# EAGLE schematic Flight Controller (EAGLE 8.2.2)
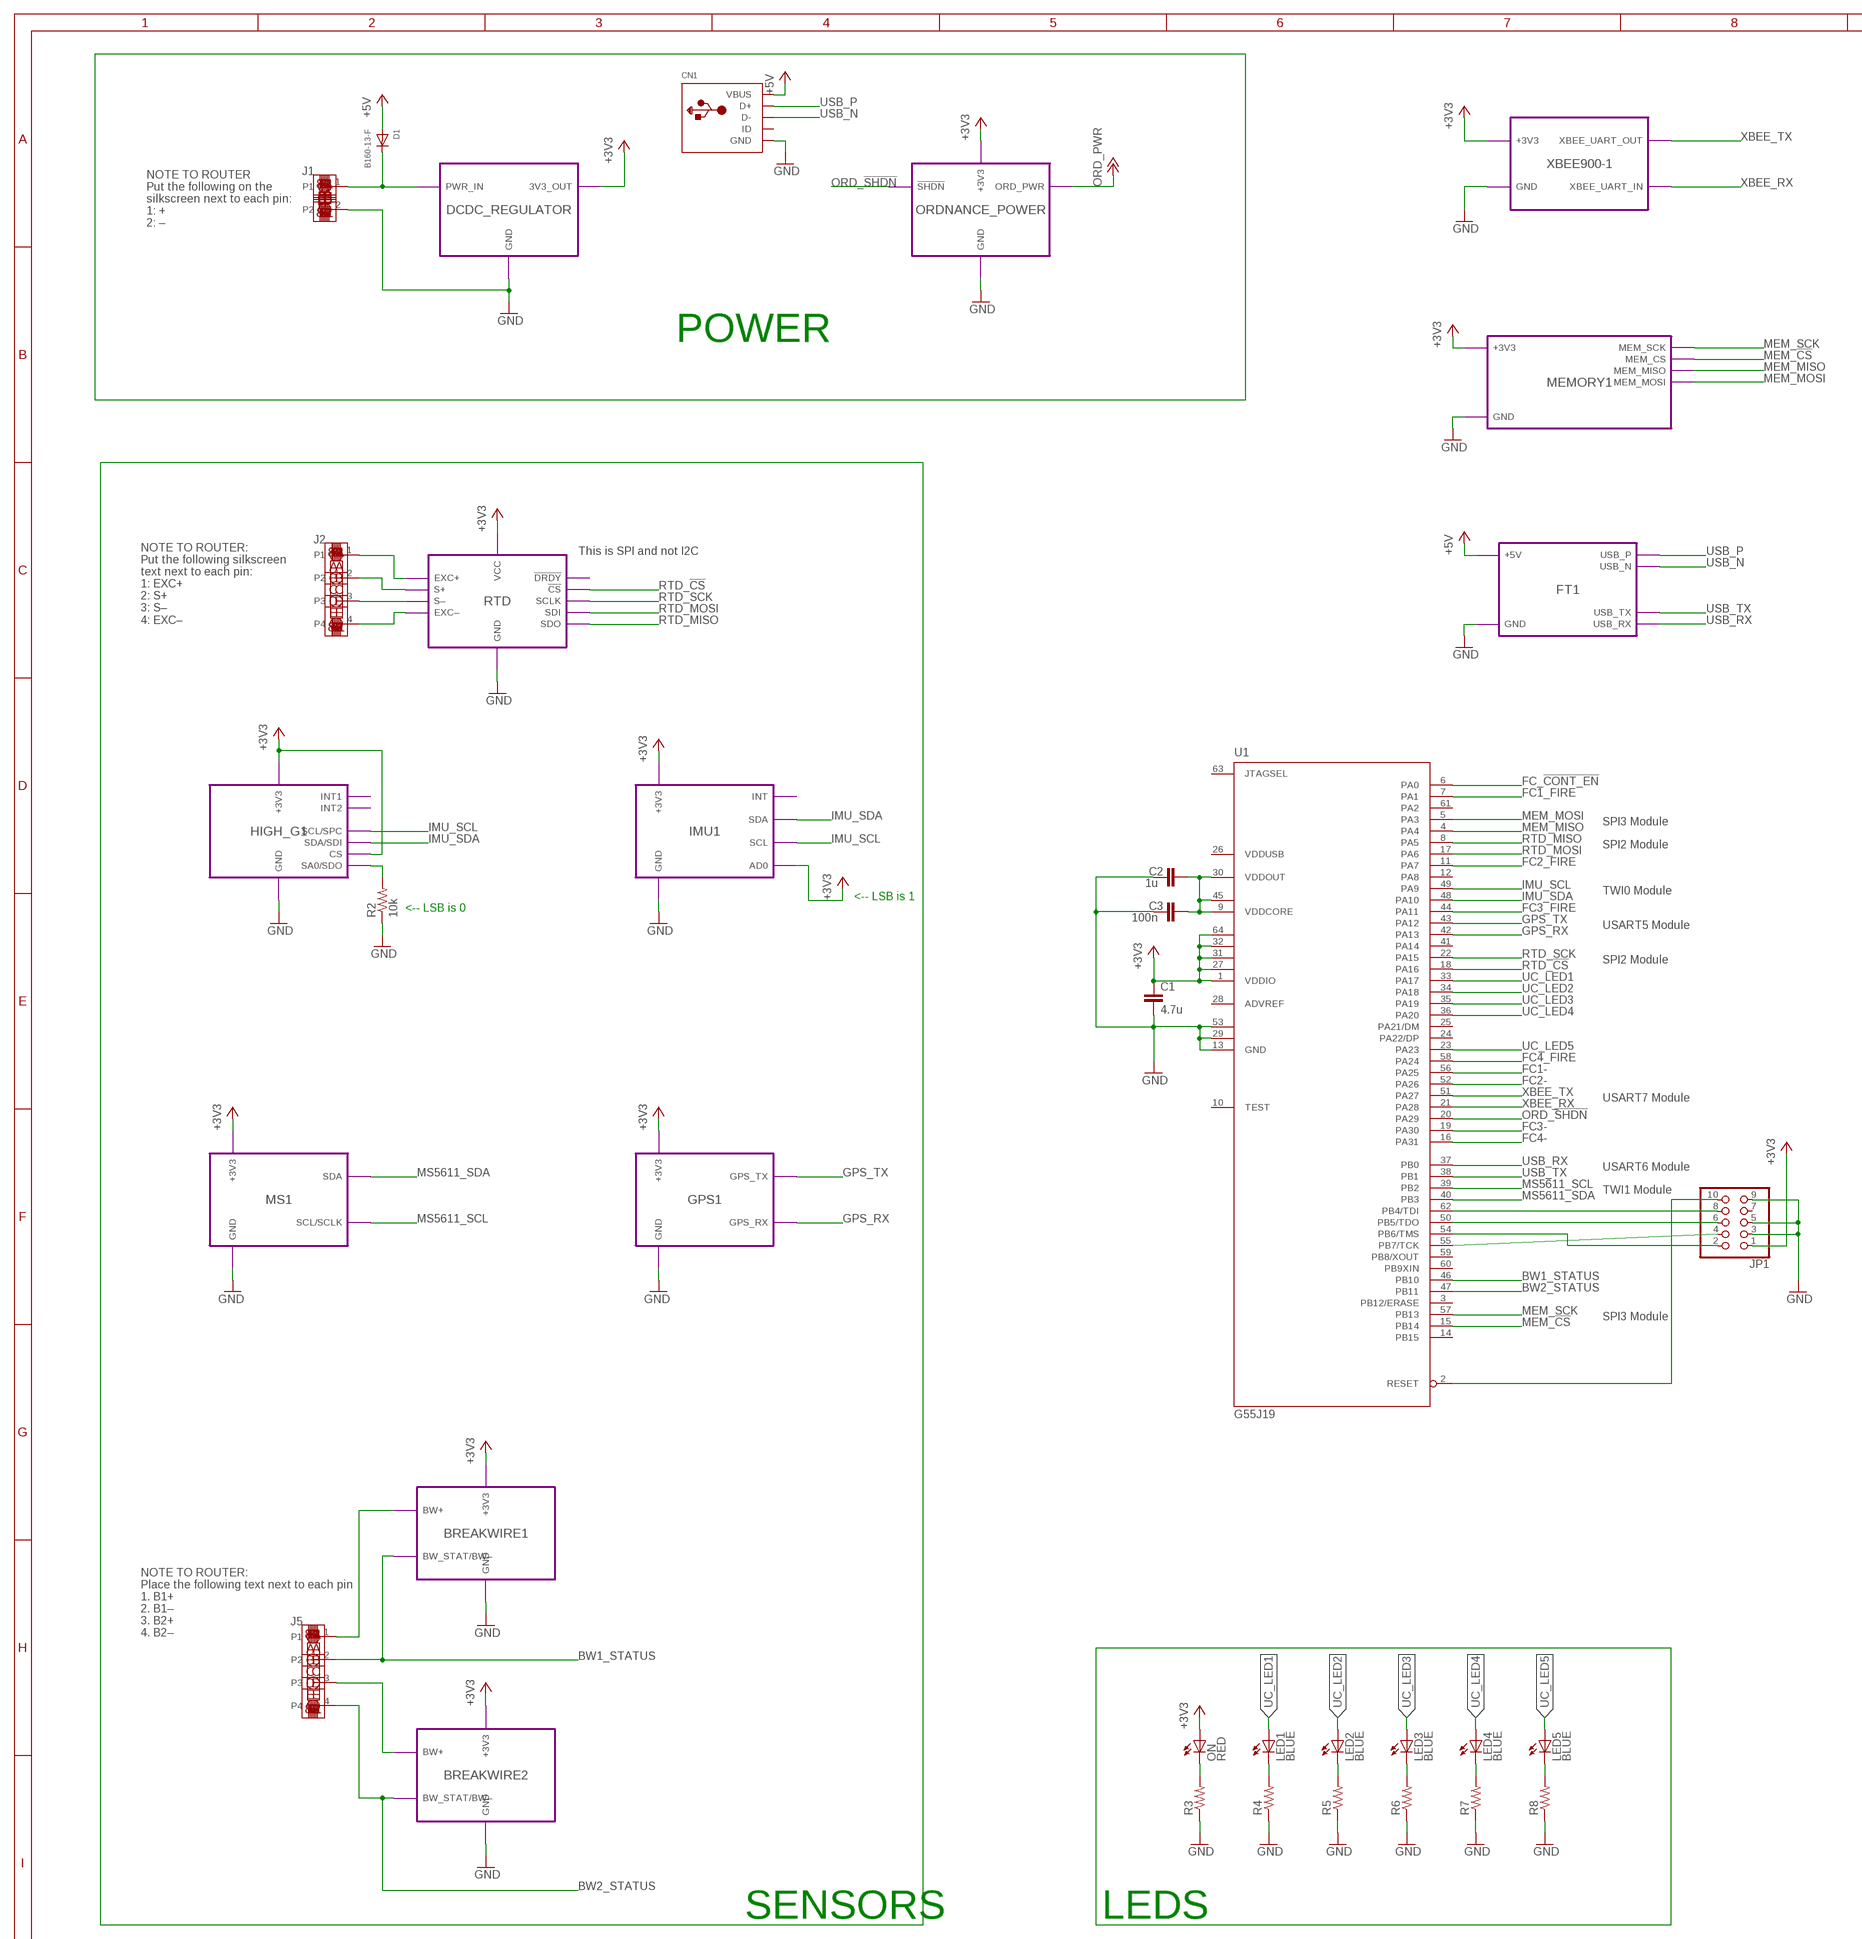
[diagram p0: schematic, sheet 1, part 1 of 2]
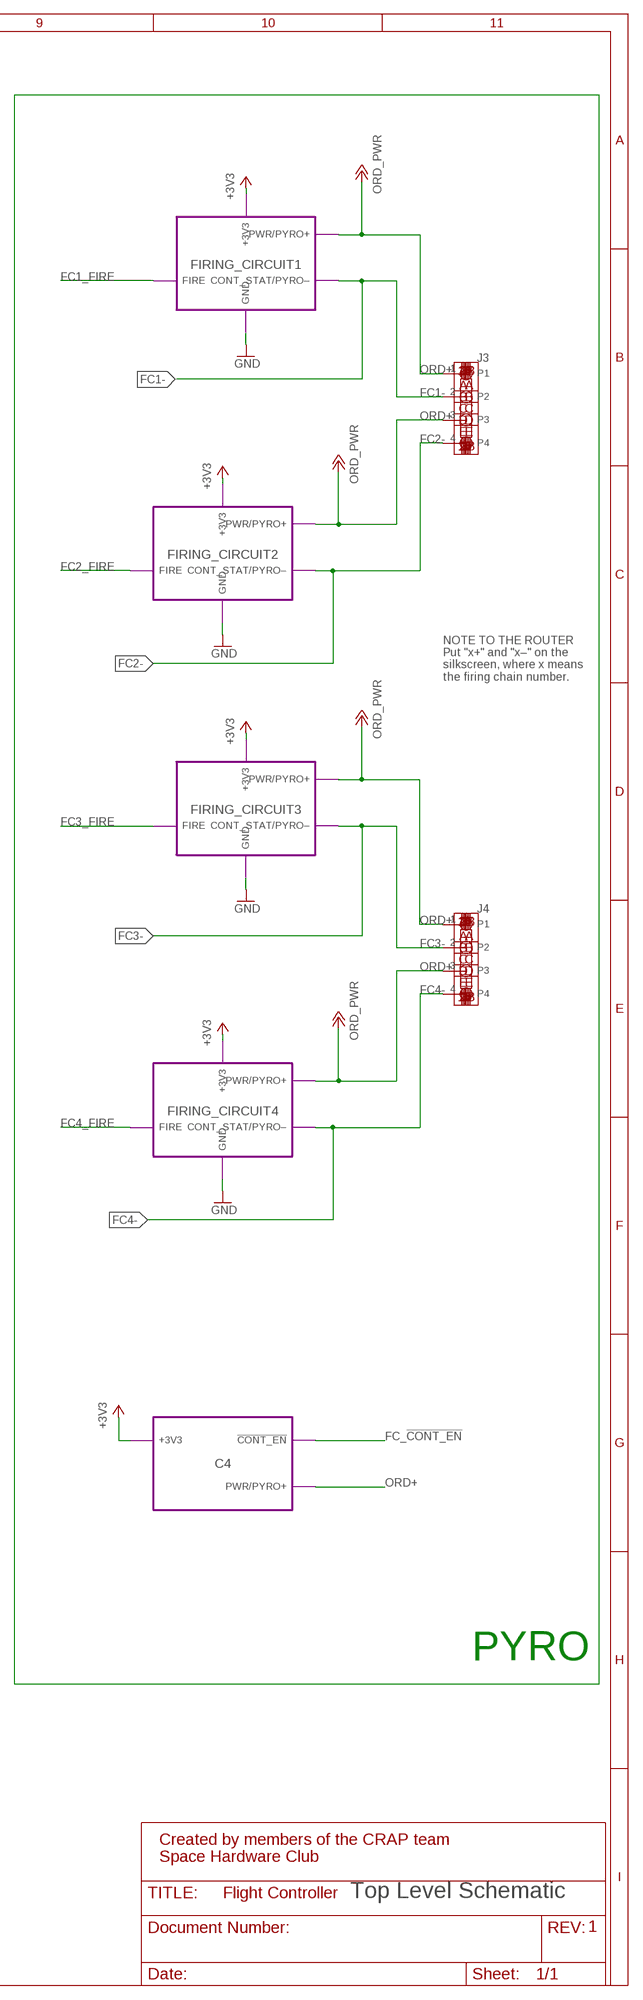
[diagram p1: schematic, sheet 1, part 2 of 2]

## Parts
C1  4.7u  C-EUC0603  [C0603]
C2  1u  C-EUC0603  [C0603]
C3  100n  C-EUC0603  [C0603]
CN1  USBMINIB  [USB-MINIB]
D1  B160-13-F  DIODESMA  [SMADIODE]
J1  2POS_SCREWTERM  [2POS_0.1]
J2  4POS_SCREWTERM  [4POS_0.1]
J3  4POS_SCREWTERM  [4POS_0.1]
J4  4POS_SCREWTERM  [4POS_0.1]
J5  4POS_SCREWTERM  [4POS_0.1]
JP1  AVR_JTAG  [2X05]
LED1  BLUE  LEDCHIPLED_0603  [CHIPLED_0603]
LED2  BLUE  LEDCHIPLED_0603  [CHIPLED_0603]
LED3  BLUE  LEDCHIPLED_0603  [CHIPLED_0603]
LED4  BLUE  LEDCHIPLED_0603  [CHIPLED_0603]
LED5  BLUE  LEDCHIPLED_0603  [CHIPLED_0603]
ON  RED  LEDCHIPLED_0603  [CHIPLED_0603]
R2  10k  R-US_R0603  [R0603]
R3  R-US_R0603  [R0603]
R4  R-US_R0603  [R0603]
R5  R-US_R0603  [R0603]
R6  R-US_R0603  [R0603]
R7  R-US_R0603  [R0603]
R8  R-US_R0603  [R0603]
U1  G55J19  ATSAMG55J19  [SQFP-S-10X10-64]

## Module instances
DCDC_REGULATOR = DCDC_REGULATOR (part numbers offset by 100)
ORDNANCE_POWER = ORDNANCE (part numbers offset by 300)
RTD = RTD (part numbers offset by 400)
XBEE900-1 = XBEE900 (part numbers offset by 500)
MEMORY1 = MEMORY (part numbers offset by 1700)
GPS1 = GPS (part numbers offset by 800)
FIRING_CIRCUIT1 = FIRING_CIRCUIT (part numbers offset by 1400)
BREAKWIRE2 = BREAKWIRE (part numbers offset by 1000)
BREAKWIRE1 = BREAKWIRE (part numbers offset by 900)
IMU1 = IMU (part numbers offset by 600)
HIGH_G1 = HIGH_G (part numbers offset by 200)
FIRING_CIRCUIT2 = FIRING_CIRCUIT (part numbers offset by 1300)
FIRING_CIRCUIT3 = FIRING_CIRCUIT (part numbers offset by 1200)
FIRING_CIRCUIT4 = FIRING_CIRCUIT (part numbers offset by 1100)
MS1 = MS5611 (part numbers offset by 700)
C4 = CONTINUTITY (part numbers offset by 1500)
FT1 = FTDI (part numbers offset by 1600)

## Nets
+3V3: C1.1 JP1.1(TCK) ON.A U1.1(VDDIO) U1.27(VDDIO) U1.31(VDDIO) U1.32(VDDIO) U1.64(VDDIO) ; port DCDC_REGULATOR.3V3_OUT RTD.VCC MS1.+3V3 BREAKWIRE1.+3V3 BREAKWIRE2.+3V3 ORDNANCE_POWER.+3V3 XBEE900-1.+3V3 FIRING_CIRCUIT4.+3V3 FIRING_CIRCUIT3.+3V3 FIRING_CIRCUIT2.+3V3 FIRING_CIRCUIT1.+3V3 IMU1.+3V3 HIGH_G1.CS HIGH_G1.+3V3 GPS1.+3V3 MEMORY1.+3V3 IMU1.AD0 C4.+3V3
+5V: CN1.VBUS D1.A ; port FT1.+5V
BW1_STATUS: J5.2 U1.46(PB10) ; port BREAKWIRE1.BW_STAT/BW–
BW2_STATUS: J5.4 U1.47(PB11) ; port BREAKWIRE2.BW_STAT/BW–
FC1-: J3.2 U1.56(PA25) ; port FIRING_CIRCUIT1.CONT_STAT/PYRO–
FC1_FIRE: U1.7(PA1) ; port FIRING_CIRCUIT1.FIRE
FC2-: J3.4 U1.52(PA26) ; port FIRING_CIRCUIT2.CONT_STAT/PYRO–
FC2_FIRE: U1.11(PA7) ; port FIRING_CIRCUIT2.FIRE
FC3-: J4.2 U1.19(PA30) ; port FIRING_CIRCUIT3.CONT_STAT/PYRO–
FC3_FIRE: U1.44(PA11) ; port FIRING_CIRCUIT3.FIRE
FC4-: J4.4 U1.16(PA31) ; port FIRING_CIRCUIT4.CONT_STAT/PYRO–
FC4_FIRE: U1.58(PA24) ; port FIRING_CIRCUIT4.FIRE
FC_!CONT_EN: U1.6(PA0) ; port C4.!CONT_EN
GND: C1.2 C2.1 C3.1 CN1.GND J1.2 JP1.3(TDO) JP1.5(TMS) JP1.9(TDI) R2.1 R3.1 R4.1 R5.1 R6.1 R7.1 R8.1 U1.13(GND) U1.29(GND) U1.53(GND) ; port DCDC_REGULATOR.GND XBEE900-1.GND RTD.GND ORDNANCE_POWER.GND FIRING_CIRCUIT1.GND BREAKWIRE2.GND IMU1.GND BREAKWIRE1.GND HIGH_G1.GND FIRING_CIRCUIT2.GND FIRING_CIRCUIT3.GND FIRING_CIRCUIT4.GND GPS1.GND MS1.GND MEMORY1.GND FT1.GND
GPS_RX: U1.42(PA13) ; port GPS1.GPS_RX
GPS_TX: U1.43(PA12) ; port GPS1.GPS_TX
IMU_SCL: U1.49(PA9) ; port HIGH_G1.SCL/SPC IMU1.SCL
IMU_SDA: U1.48(PA10) ; port HIGH_G1.SDA/SDI IMU1.SDA
MEM_!CS: U1.15(PB14) ; port MEMORY1.MEM_CS
MEM_MISO: U1.4(PA4) ; port MEMORY1.MEM_MISO
MEM_MOSI: U1.5(PA3) ; port MEMORY1.MEM_MOSI
MEM_SCK: U1.57(PB13) ; port MEMORY1.MEM_SCK
MS5611_SCL: U1.39(PB2) ; port MS1.SCL/SCLK
MS5611_SDA: U1.40(PB3) ; port MS1.SDA
N$1: JP1.2(GND) U1.54(PB6/TMS)
N$2: JP1.4(VCC) U1.55(PB7/TCK)
N$3: JP1.6(/RESET) U1.50(PB5/TDO)
N$4: JP1.8((TRST)) U1.62(PB4/TDI)
N$5: JP1.10(GND) U1.2(RESET)
N$6: J2.1 ; port RTD.EXC+
N$7: J2.2 ; port RTD.S+
N$8: J2.3 ; port RTD.S–
N$9: J2.4 ; port RTD.EXC–
N$11: J5.3 ; port BREAKWIRE2.BW+
N$13: J5.1 ; port BREAKWIRE1.BW+
N$15: R2.2 ; port HIGH_G1.SA0/SDO
N$24: LED1.C R4.2
N$25: LED2.C R5.2
N$26: LED3.C R6.2
N$27: LED4.C R7.2
N$28: LED5.C R8.2
N$30: ON.C R3.2
ORD+: J3.1 J3.3 J4.1 J4.3 ; port ORDNANCE_POWER.ORD_PWR FIRING_CIRCUIT1.PWR/PYRO+ FIRING_CIRCUIT2.PWR/PYRO+ FIRING_CIRCUIT3.PWR/PYRO+ FIRING_CIRCUIT4.PWR/PYRO+ C4.PWR/PYRO+ ; supply symbol labelled ORD_PWR
ORD_!SHDN: U1.20(PA29) ; port ORDNANCE_POWER.!SHDN
RTD_!CS: U1.18(PA16) ; port RTD.!CS
RTD_MISO: U1.8(PA5) ; port RTD.SDO
RTD_MOSI: U1.17(PA6) ; port RTD.SDI
RTD_SCK: U1.22(PA15) ; port RTD.SCLK
UC_LED1: LED1.A U1.33(PA17)
UC_LED2: LED2.A U1.34(PA18)
UC_LED3: LED3.A U1.35(PA19)
UC_LED4: LED4.A U1.36(PA20)
UC_LED5: LED5.A U1.23(PA23)
USB_N: CN1.D- ; port FT1.USB_N
USB_P: CN1.D+ ; port FT1.USB_P
USB_RX: U1.37(PB0) ; port FT1.USB_RX
USB_TX: U1.38(PB1) ; port FT1.USB_TX
VCC_IN: D1.C J1.1 ; port DCDC_REGULATOR.PWR_IN
VDDOUT: C2.2 C3.2 U1.9(VDDCORE) U1.30(VDDOUT) U1.45(VDDCORE)
XBEE_RX: U1.21(PA28) ; port XBEE900-1.XBEE_UART_IN
XBEE_TX: U1.51(PA27) ; port XBEE900-1.XBEE_UART_OUT
Unconnected: CN1.ID JP1.7((NC)) U1.3(PB12/ERASE) U1.10(TEST) U1.12(PA8) U1.14(PB15) U1.24(PA22/DP) U1.25(PA21/DM) U1.26(VDDUSB) U1.28(ADVREF) U1.41(PA14) U1.59(PB8/XOUT) U1.60(PB9XIN) U1.61(PA2) U1.63(JTAGSEL)

## Notes on the sheet
- NOTE TO ROUTER
  Put the following on the
  silkscreen next to each pin:
  1: +
  2: –
- POWER
- This is SPI and not I2C
- NOTE TO ROUTER:
  Put the following silkscreen
  text next to each pin:
  1: EXC+
  2: S+
  3: S–
  4: EXC–
- NOTE TO THE ROUTER
  Put "x+" and "x–" on the
  silkscreen, where x means
  the firing chain number.
- SPI3 Module
- SPI2 Module
- TWI0 Module
- <-- LSB is 1
- <-- LSB is 0
- USART5 Module
- SPI2 Module
- USART7 Module
- USART6 Module
- TWI1 Module
- SPI3 Module
- NOTE TO ROUTER:
  Place the following text next to each pin
  1. B1+
  2. B1–
  3. B2+
  4. B2–
- PYRO
- Created by members of the CRAP team
  Space Hardware Club
- Top Level Schematic
- SENSORS | LEDS | 1

## Library data of the parts
C1-C3 = rcl:C-EU: CAPACITOR, European symbol
CN1 = adafruit:USB: USB Connectors USBMINIB - Surface Mount Female Mini-B USB Connector 4UConnector: 06564 By microbuilder.eu Thru-hole RA Female Mini-B USB Connector 4UConnector: 18732 By ladyada.net
D1 = adafruit:DIODE: Diode SMADIODE - SMA Surface Mount Package 20V 1A Schottky Diode Digikey: 641-1014-6-ND DO-1N4148 - Through Hole Small Current Diode SOD-123 20V 1 A (.5mV Vf) Schottky Diode - Digikey: MBRX120TPMSCT-ND SOD-323 10V 570mA (.38mV Vf, 3ns) Schottky Diode - Digikey: ZLLS410CT-ND SOD-523 30V 30mA Schottky Diode (RB751S-40TE61) - Digikey: RB751S-40TE61CT-ND SOT23-R/W - SOT23 Package (R = Solder Paste/Reflow Ovens, W = Hand-Soldering) BAT54Film 40V 300mA - Digikey: 497-7162-1-ND
J1 = CRAP Parts:2POS_SCREWTERM
J2-J5 = CRAP Parts:4POS_SCREWTERM
JP1 = atmel:AVR_JTAG: PIN HEADER
LED1-LED5 ON = led:LED: LED OSRAM: - CHIPLED LG R971, LG N971, LY N971, LG Q971, LY Q971, LO R971, LY R971 LH N974, LH R974 LS Q976, LO Q976, LY Q976 LO Q996 - Hyper CHIPLED LW Q18S LB Q993, LB Q99A, LB R99A - SideLED LS A670, LO A670, LY A670, LG A670, LP A670 LB A673, LV A673, LT A673, LW A673 LH A674 LY A675 LS A676, LA A676, LO A676, LY A676, LW A676 LS A679, LY A679, LG A679 - Hyper Micro SIDELED® LS Y876, LA Y876, LO Y876, LY Y876 LT Y87S - SmartLED LW L88C, LW L88S LB L89C, LB L89S, LG L890 LS L89K, LO L89K, LY L89K LS L896, LA L896, LO L896, LY L896 - TOPLED LS T670, LO T670, LY T670, LG T670, LP T670 LSG T670, LSP T670, LSY T670, LOP T670, LYG T670 LG T671, LOG T671, LSG T671 LB T673, LV T673, LT T673, LW T673 LH T674 LS T676, LA T676, LO T676, LY T676, LB T676, LH T676, LSB T676, LW T676 LB T67C, LV T67C, LT T67C, LS T67K, LO T67K, LY T67K, LW E67C LS E67B, LA E67B, LO E67B, LY E67B, LB E67C, LV E67C, LT E67C LW T67C LS T679, LY T679, LG T679 LS T770, LO T770, LY T770, LG T770, LP T770 LB T773, LV T773, LT T773, LW T773 LH T774 LS E675, LA E675, LY E675, LS T675 LS T776, LA T776, LO T776, LY T776, LB T776 LHGB T686 LT T68C, LB T68C - Hyper Mini TOPLED® LB M676 - Mini TOPLED Santana® LG M470 LS M47K, LO M47K, LY M47K Source: http://www.osram.convergy.de LUXEON: - LUMILED® LXK2-PW12-R00, LXK2-PW12-S00, LXK2-PW14-U00, LXK2-PW14-V00 LXK2-PM12-R00, LXK2-PM12-S00, LXK2-PM14-U00 LXK2-PE12-Q00, LXK2-PE12-R00, LXK2-PE12-S00, LXK2-PE14-T00, LXK2-PE14-U00 LXK2-PB12-K00, LXK2-PB12-L00, LXK2-PB12-M00, LXK2-PB14-N00, LXK2-PB14-P00, LXK2-PB14-Q00 LXK2-PR12-L00, LXK2-PR12-M00, LXK2-PR14-Q00, LXK2-PR14-R00 LXK2-PD12-Q00, LXK2-PD12-R00, LXK2-PD12-S00 LXK2-PH12-R00, LXK2-PH12-S00 LXK2-PL12-P00, LXK2-PL12-Q00, LXK2-PL12-R00 Source: www.luxeon.com KINGBRIGHT: KA-3528ASYC Source: www.kingbright.com
R2-R8 = rcl:R-US_: RESISTOR, American symbol
U1 = atmel:ATSAMG55J19: To see a more detailed description of the pinout, see Product Dependencies in the G55 datasheet. http://www.atmel.com/Images/Atmel-11289-32-bit-Cortex-M4-Microcontroller-SAM-G55_Datasheet.pdf

## Module DCDC_REGULATOR
Ports: 3V3_OUT(pwr) PWR_IN(in) GND(pwr)
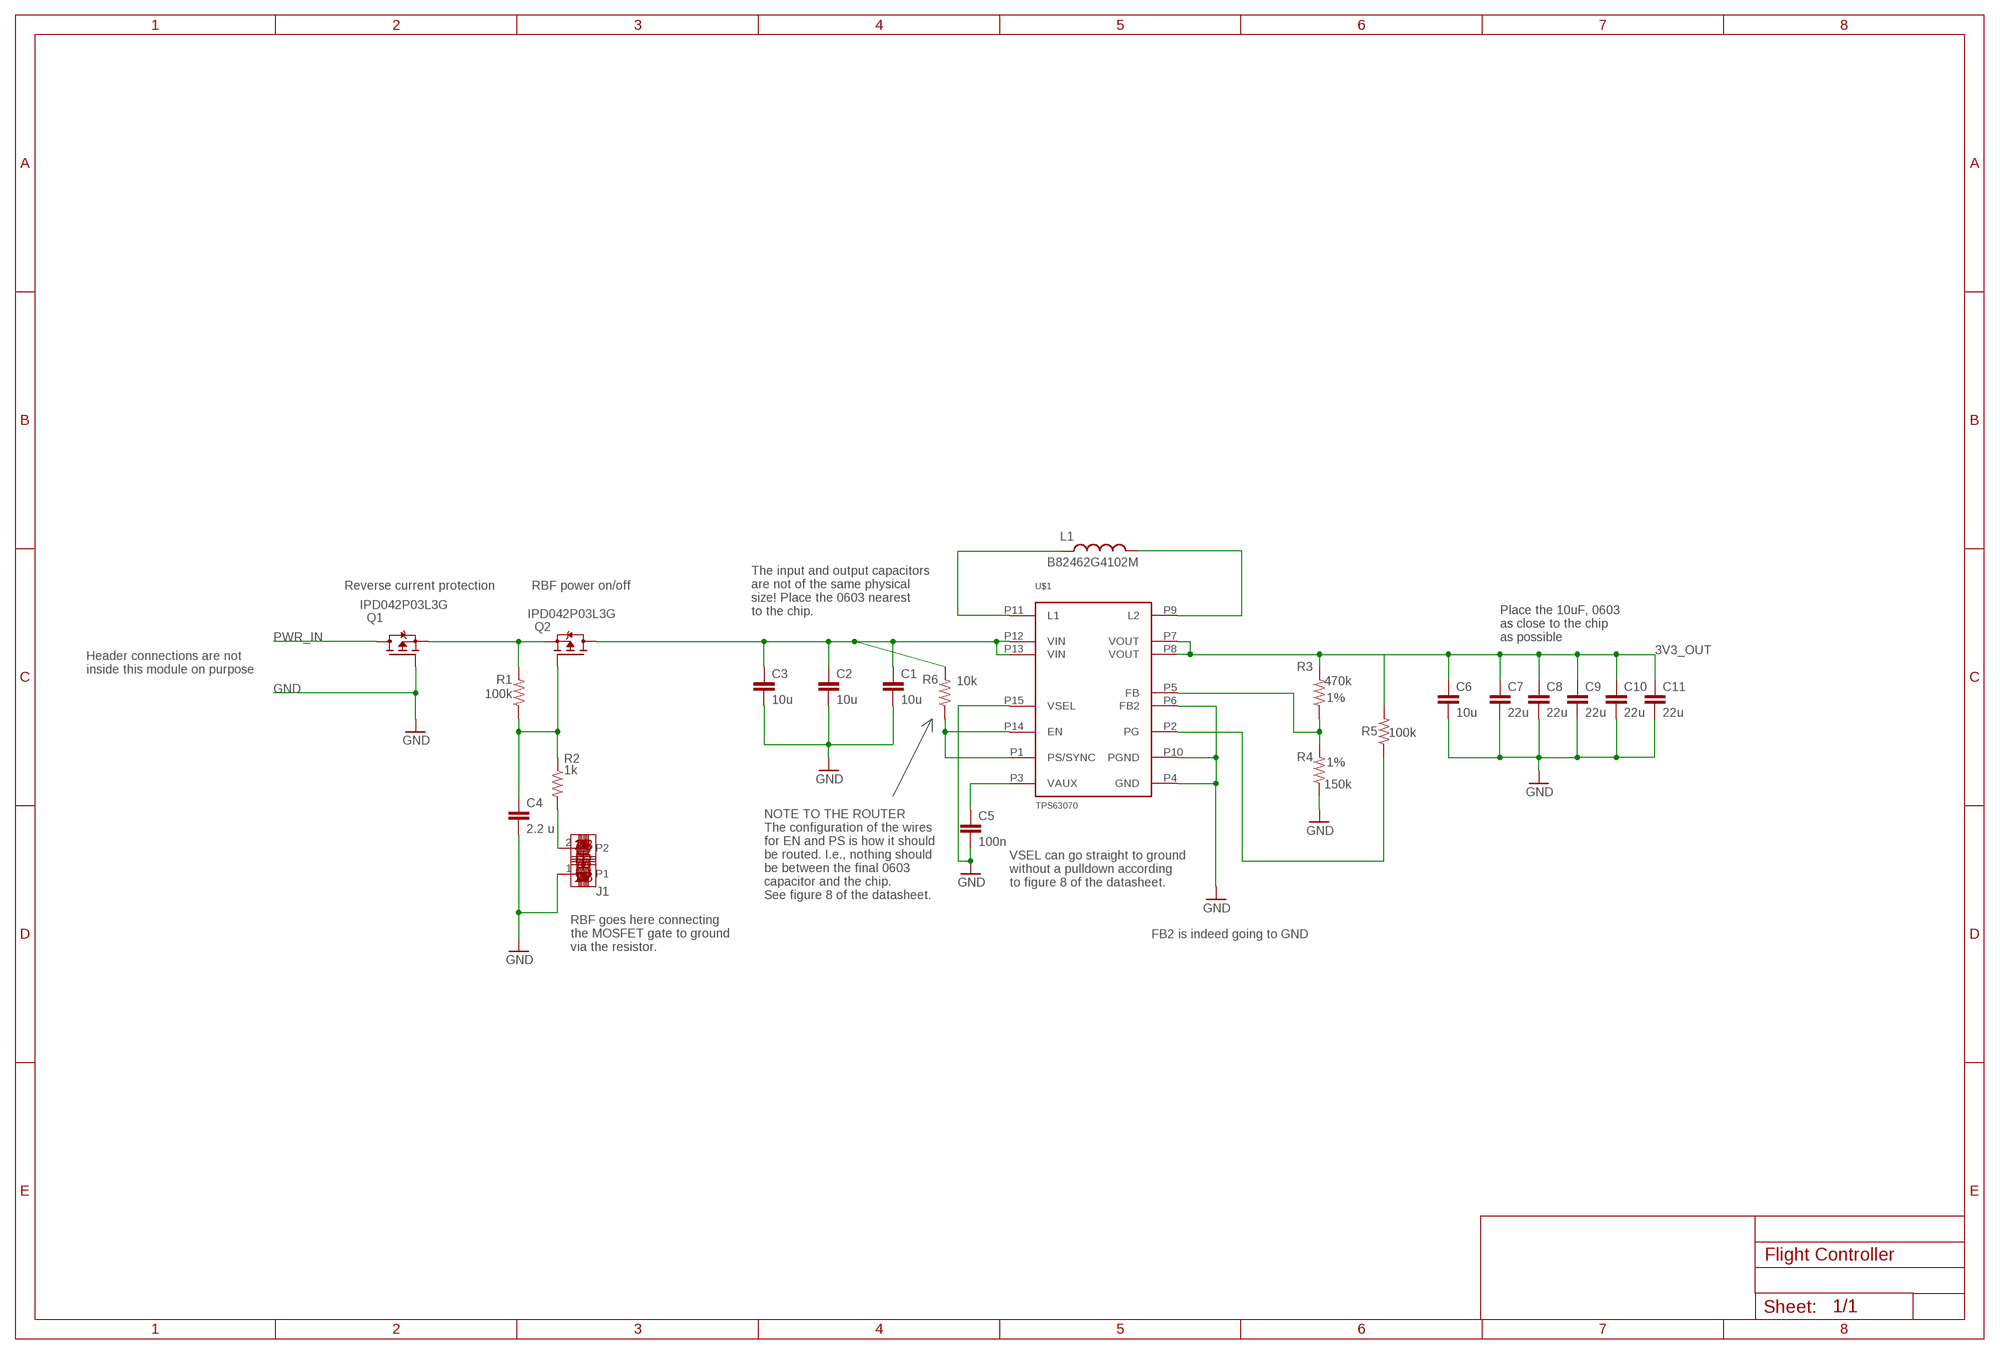
[diagram p2: schematic, module DCDC_REGULATOR, sheet 1]

### Parts
C1  10u  C-EUC0603  [C0603]
C2  10u  C-EUC0805  [C0805]
C3  10u  C-EUC0805  [C0805]
C4  2.2 u  C-EUC0603  [C0603]
C5  100n  C-EUC0603  [C0603]
C6  10u  C-EUC0805  [C0805]
C7  22u  C-EUC1206  [C1206]
C8  22u  C-EUC1206  [C1206]
C9  22u  C-EUC1206  [C1206]
C10  22u  C-EUC1206  [C1206]
C11  22u  C-EUC1206  [C1206]
J1  2POS_SCREWTERM  [2POS_0.1]
L1  B82462G4102M  [B82462G4]
Q1  IPD042P03L3G  [TO252]
Q2  IPD042P03L3G  [TO252]
R1  100k  R-US_R0603  [R0603]
R2  1k  R-US_R0603  [R0603]
R3  470k  R-US_R0603  [R0603]
R4  150k  R-US_R0603  [R0603]
R5  100k  R-US_R0603  [R0603]
R6  10k  R-US_R0603  [R0603]
U$1  TPS6307X  [VQFN15_2.5X3]

### Nets
3V3_OUT: C6.1 C7.1 C8.1 C9.1 C10.1 C11.1 R3.2 R5.2 U$1.P7(VOUT) U$1.P8(VOUT)
GND: C1.2 C2.2 C3.2 C4.2 C5.2 C6.2 C7.2 C8.2 C9.2 C10.2 C11.2 J1.1 Q1.1(G) R4.1 U$1.P4(GND) U$1.P6(FB2) U$1.P10(PGND) U$1.P15(VSEL)
N$1: Q1.3(S) Q2.3(S) R1.2
N$3: L1.P$1 U$1.P11(L1)
N$4: C4.1 Q2.1(G) R1.1 R2.1
N$5: L1.P$2 U$1.P9(L2)
N$6: J1.2 R2.2
N$7: C5.1 U$1.P3(VAUX)
N$9: R5.1 U$1.P2(PG)
N$10: R3.1 R4.2 U$1.P5(FB)
N$11: R6.1 U$1.P1(PS/SYNC) U$1.P14(EN)
PWR_IN: Q1.2(D)
VIN: C1.1 C2.1 C3.1 Q2.2(D) R6.2 U$1.P12(VIN) U$1.P13(VIN)

### Notes on the sheet
- Reverse current protection | RBF power on/off
- The input and output capacitors
  are not of the same physical
  size! Place the 0603 nearest 
  to the chip.
- Place the 10uF, 0603
  as close to the chip
  as possible
- Header connections are not
  inside this module on purpose
- VSEL can go straight to ground
  without a pulldown according
  to figure 8 of the datasheet.
- NOTE TO THE ROUTER
  The configuration of the wires
  for EN and PS is how it should
  be routed. I.e., nothing should
  be between the final 0603
  capacitor and the chip.
  See figure 8 of the datasheet.
- FB2 is indeed going to GND
- RBF goes here connecting
  the MOSFET gate to ground
  via the resistor.

### Library data of the parts
C1-C11 = rcl:C-EU: CAPACITOR, European symbol
J1 = CRAP Parts:2POS_SCREWTERM
L1 = inductor-coilcraft:B82462G4102M
Q1 Q2 = transistor-fet:IPD042P03L3G
R1 R2 R5 R6 = rcl:R-US_: RESISTOR, American symbol
R3 R4 = rcl:R-US_: RESISTOR, American symbol; TOLERANCE: 1%
U$1 = texas:TPS6307X

## Module FIRING_CIRCUIT
Ports: GND(pwr) PWR/PYRO+(io) CONT_STAT/PYRO–(io) +3V3(pwr) FIRE(in)
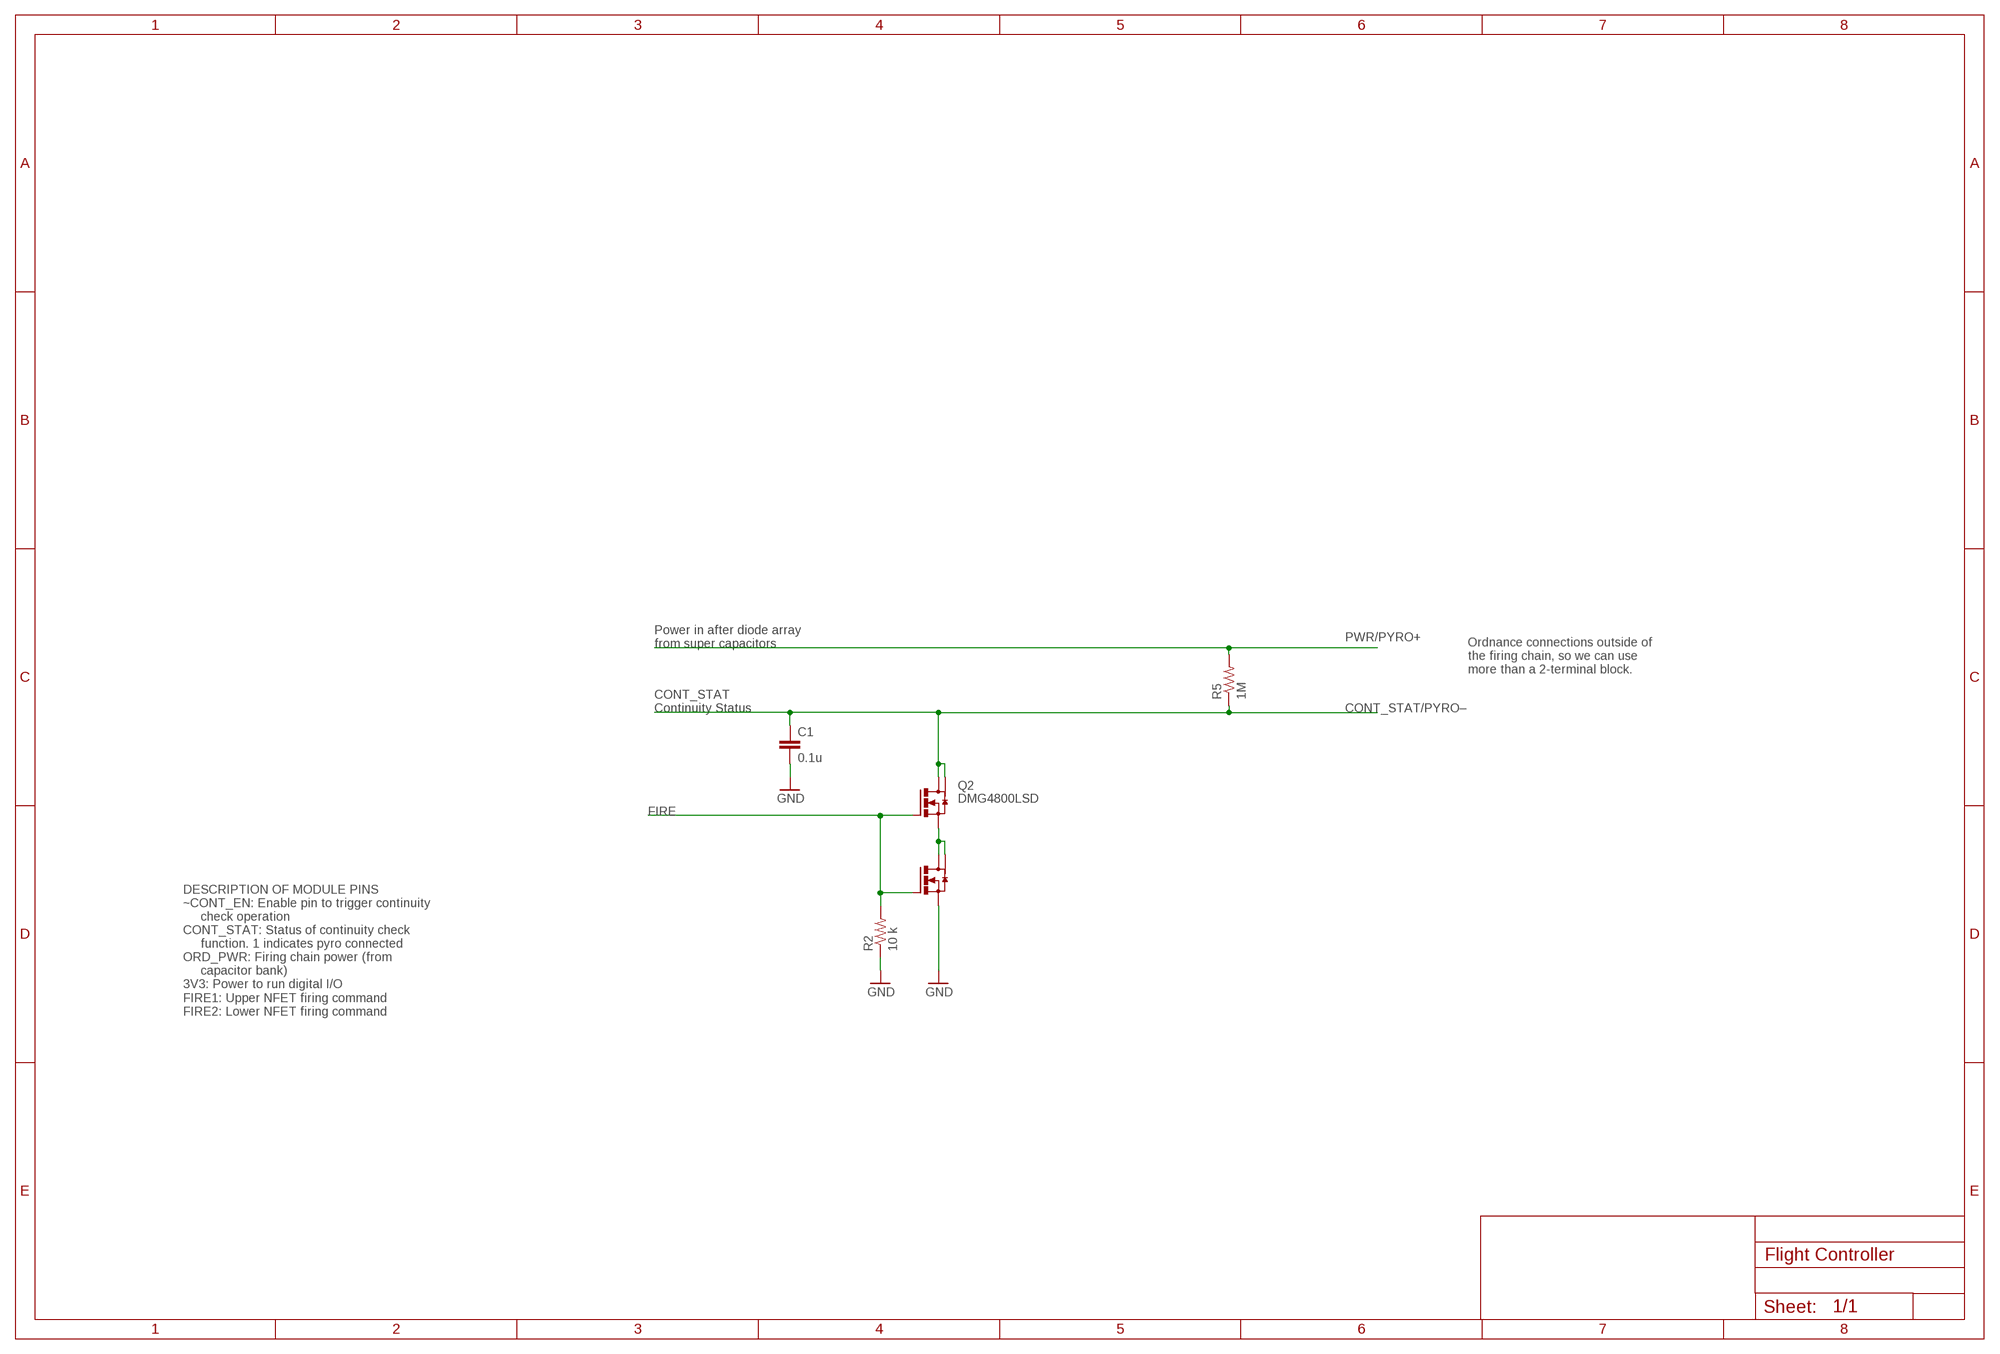
[diagram p3: schematic, module FIRING_CIRCUIT, sheet 1]

### Parts
C1  0.1u  C-EUC0603  [C0603]
Q2  DMG4800LSD  [SO-08]
R2  10 k  R-US_R0603  [R0603]
R5  1M  R-US_R0603  [R0603]

### Nets
CONT_STAT/PYRO–: C1.1 Q2.7(D1) Q2.8(D1) R5.1
FIRE: Q2.2(G1) Q2.4(G2) R2.2
GND: C1.2 Q2.3(S2) R2.1
N$1: Q2.1(S1) Q2.5(D2) Q2.6(D2)
PWR/PYRO+: R5.2

### Notes on the sheet
- Power in after diode array
  from super capacitors
- Ordnance connections outside of
  the firing chain, so we can use
  more than a 2-terminal block.
- CONT_STAT
  Continuity Status
- DESCRIPTION OF MODULE PINS
  ~CONT_EN: Enable pin to trigger continuity
       check operation
  CONT_STAT: Status of continuity check
       function. 1 indicates pyro connected
  ORD_PWR: Firing chain power (from
       capacitor bank)
  3V3: Power to run digital I/O
  FIRE1: Upper NFET firing command
  FIRE2: Lower NFET firing command

### Library data of the parts
C1 = rcl:C-EU: CAPACITOR, European symbol
Q2 = transistor-power:DMG4800LSD
R2 R5 = rcl:R-US_: RESISTOR, American symbol

## Module ORDNANCE
Ports: +3V3(pwr) GND(pwr) !SHDN(in) ORD_PWR(pwr)
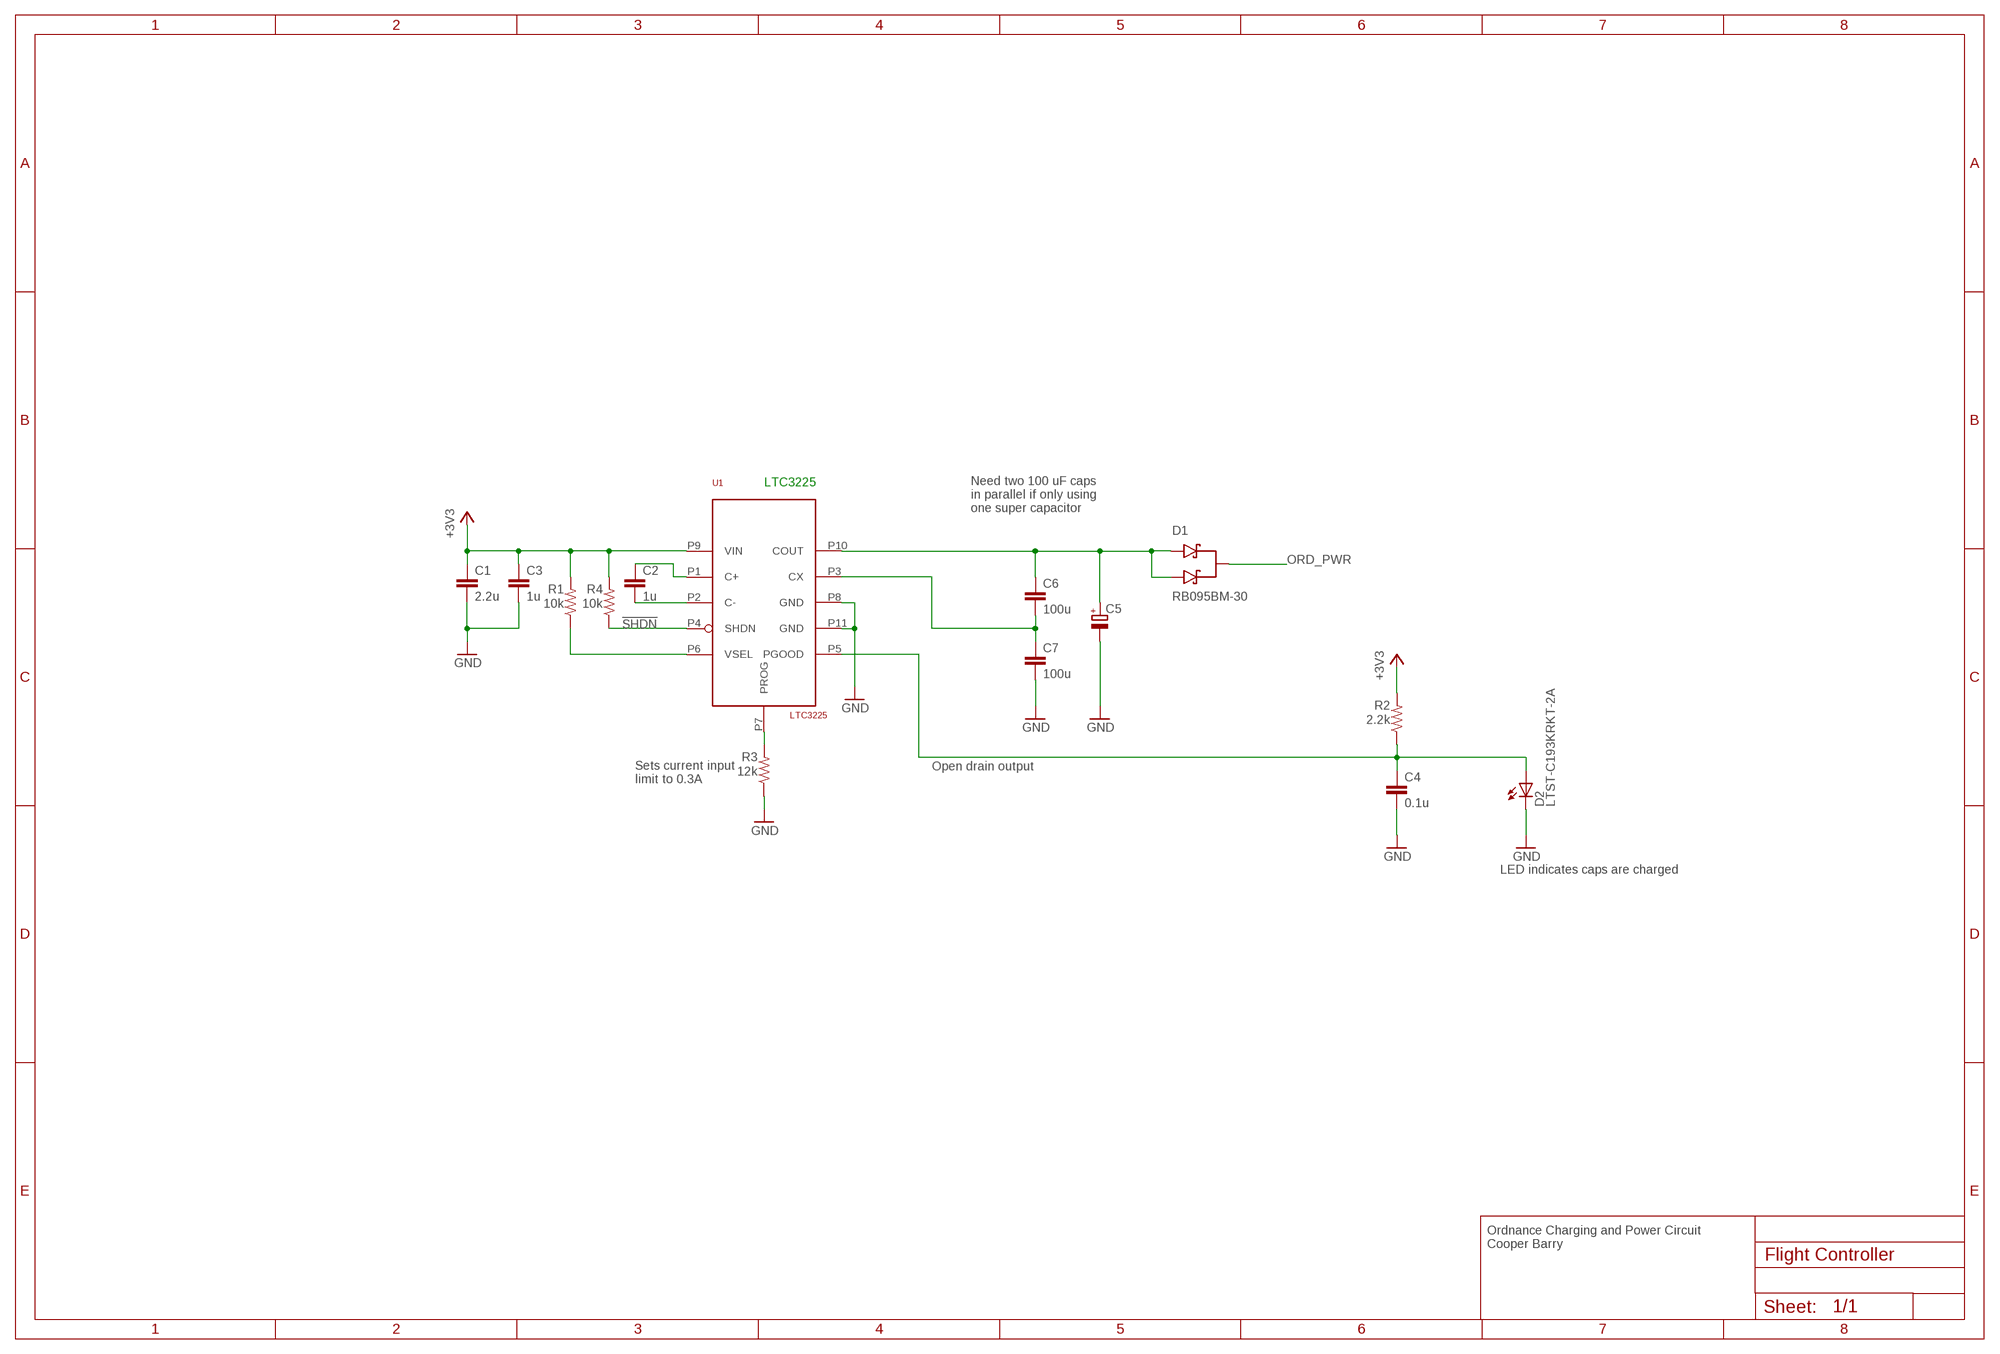
[diagram p4: schematic, module ORDNANCE, sheet 1]

### Parts
C1  2.2u  C-EUC0805  [C0805]
C2  1u  C-EUC0402  [C0402]
C3  1u  C-EUC0603  [C0603]
C4  0.1u  C-EUC0603  [C0603]
C5  AVX_1F_5VFOLDED  [AVX_1F_5V_FOLDED]
C6  100u  C-EUC1206  [C1206]
C7  100u  C-EUC1206  [C1206]
D1  RB095BM-30  [TO252]
D2  LTST-C193KRKT-2A  LEDCHIP-LED0603  [CHIP-LED0603]
R1  10k  R-US_R0603  [R0603]
R2  2.2k  R-US_R0603  [R0603]
R3  12k  R-US_R0603  [R0603]
R4  10k  R-US_R0603  [R0603]
U1  LTC3225  [DFN10-2X3]

### Nets
!SHDN: R4.1 U1.P4(SHDN)
+3V3: C1.1 C3.1 R1.2 R2.2 R4.2 U1.P9(VIN)
GND: C1.2 C3.2 C4.2 C5.2(-) C7.2 D2.C R3.1 U1.P8(GND) U1.P11(GND)
N$1: C2.1 U1.P1(C+)
N$2: C2.2 U1.P2(C-)
N$3: C5.1(+) C6.1 D1.1(A1) D1.2(A2) U1.P10(COUT)
N$4: C4.1 D2.A R2.1 U1.P5(PGOOD)
N$5: R1.1 U1.P6(VSEL)
N$6: R3.2 U1.P7(PROG)
N$7: C6.2 C7.1 U1.P3(CX)
ORD_PWR: D1.3(K)

### Notes on the sheet
- LTC3225
- Need two 100 uF caps
  in parallel if only using
  one super capacitor
- Open drain output
- Sets current input
  limit to 0.3A
- LED indicates caps are charged
- Ordnance Charging and Power Circuit
  Cooper Barry

### Library data of the parts
C1-C4 C6 C7 = rcl:C-EU: CAPACITOR, European symbol
C5 = CRAP Parts:AVX_1F_5V
D1 = diode:RB095BM-30
D2 = led:LED: LED OSRAM: - CHIPLED LG R971, LG N971, LY N971, LG Q971, LY Q971, LO R971, LY R971 LH N974, LH R974 LS Q976, LO Q976, LY Q976 LO Q996 - Hyper CHIPLED LW Q18S LB Q993, LB Q99A, LB R99A - SideLED LS A670, LO A670, LY A670, LG A670, LP A670 LB A673, LV A673, LT A673, LW A673 LH A674 LY A675 LS A676, LA A676, LO A676, LY A676, LW A676 LS A679, LY A679, LG A679 - Hyper Micro SIDELED® LS Y876, LA Y876, LO Y876, LY Y876 LT Y87S - SmartLED LW L88C, LW L88S LB L89C, LB L89S, LG L890 LS L89K, LO L89K, LY L89K LS L896, LA L896, LO L896, LY L896 - TOPLED LS T670, LO T670, LY T670, LG T670, LP T670 LSG T670, LSP T670, LSY T670, LOP T670, LYG T670 LG T671, LOG T671, LSG T671 LB T673, LV T673, LT T673, LW T673 LH T674 LS T676, LA T676, LO T676, LY T676, LB T676, LH T676, LSB T676, LW T676 LB T67C, LV T67C, LT T67C, LS T67K, LO T67K, LY T67K, LW E67C LS E67B, LA E67B, LO E67B, LY E67B, LB E67C, LV E67C, LT E67C LW T67C LS T679, LY T679, LG T679 LS T770, LO T770, LY T770, LG T770, LP T770 LB T773, LV T773, LT T773, LW T773 LH T774 LS E675, LA E675, LY E675, LS T675 LS T776, LA T776, LO T776, LY T776, LB T776 LHGB T686 LT T68C, LB T68C - Hyper Mini TOPLED® LB M676 - Mini TOPLED Santana® LG M470 LS M47K, LO M47K, LY M47K Source: http://www.osram.convergy.de LUXEON: - LUMILED® LXK2-PW12-R00, LXK2-PW12-S00, LXK2-PW14-U00, LXK2-PW14-V00 LXK2-PM12-R00, LXK2-PM12-S00, LXK2-PM14-U00 LXK2-PE12-Q00, LXK2-PE12-R00, LXK2-PE12-S00, LXK2-PE14-T00, LXK2-PE14-U00 LXK2-PB12-K00, LXK2-PB12-L00, LXK2-PB12-M00, LXK2-PB14-N00, LXK2-PB14-P00, LXK2-PB14-Q00 LXK2-PR12-L00, LXK2-PR12-M00, LXK2-PR14-Q00, LXK2-PR14-R00 LXK2-PD12-Q00, LXK2-PD12-R00, LXK2-PD12-S00 LXK2-PH12-R00, LXK2-PH12-S00 LXK2-PL12-P00, LXK2-PL12-Q00, LXK2-PL12-R00 Source: www.luxeon.com KINGBRIGHT: KA-3528ASYC Source: www.kingbright.com
R1-R4 = resistor:R-US_: RESISTOR, American symbol
U1 = linear-technology:LTC3225: This Linear's SuperCap charger LTC3225. This will only draw 300mA. It uses a charge pump architecture and is also meant for 2 capacitors in series.

## Module RTD
Ports: EXC+(io) S+(io) S–(io) EXC–(io) GND(pwr) VCC(pwr) !DRDY(out) !CS(in) SCLK(in) SDI(in) SDO(out)
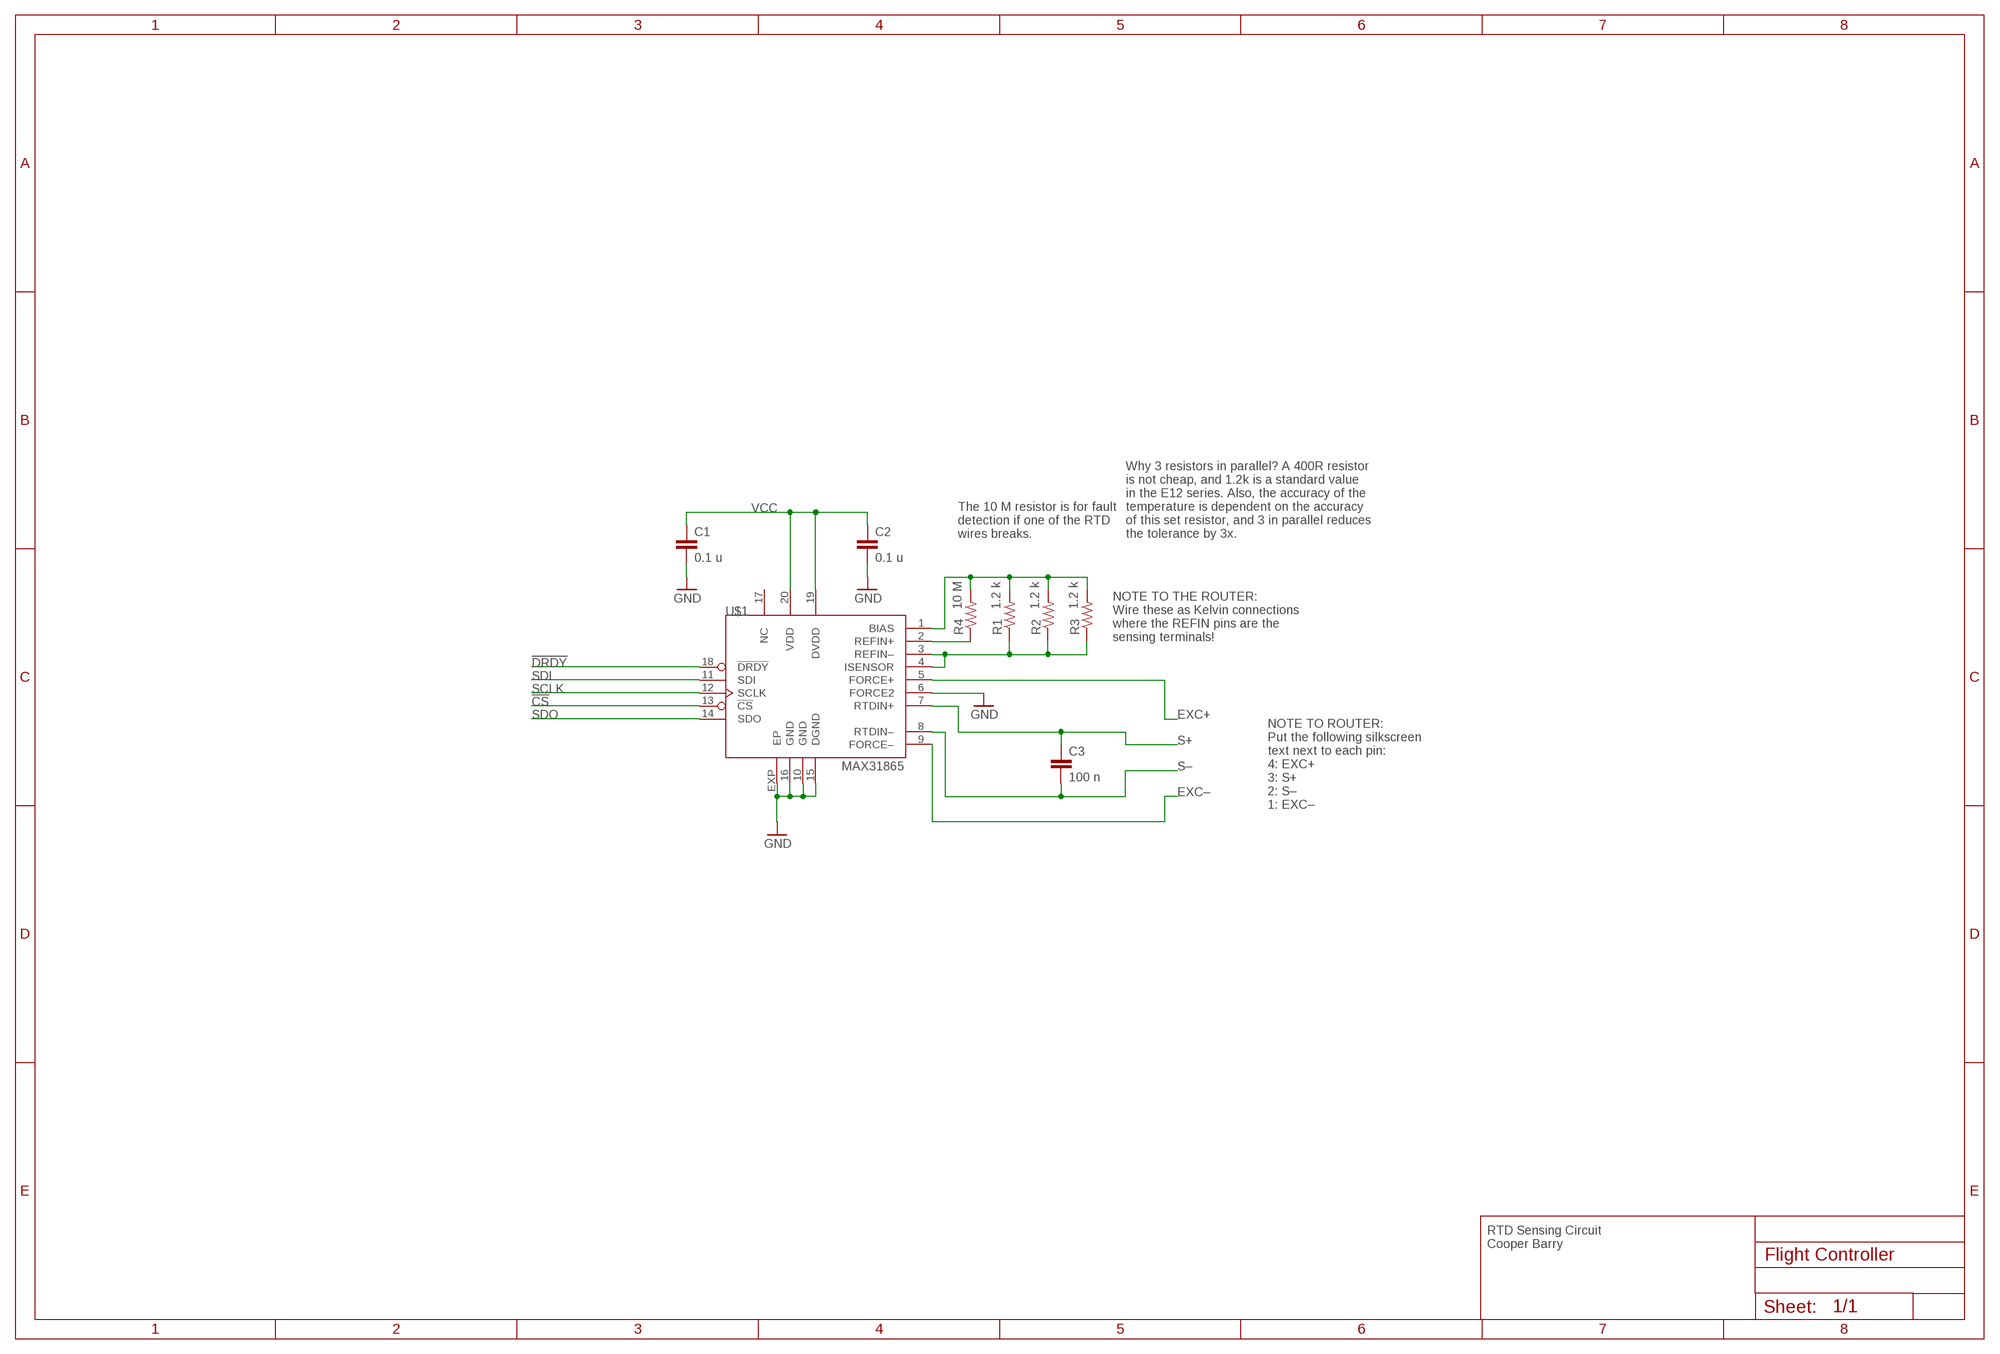
[diagram p5: schematic, module RTD, sheet 1]

### Parts
C1  0.1 u  C-EUC0603  [C0603]
C2  0.1 u  C-EUC0603  [C0603]
C3  100 n  C-EUC0603  [C0603]
R1  1.2 k  R-US_R0603  [R0603]
R2  1.2 k  R-US_R0603  [R0603]
R3  1.2 k  R-US_R0603  [R0603]
R4  10 M  R-US_R0603  [R0603]
U$1  MAX31865  [TQFN20-5X5]

### Nets
!CS: U$1.13(!CS)
!DRDY: U$1.18(!DRDY)
EXC+: U$1.5(FORCE+)
EXC–: U$1.9(FORCE–)
GND: C1.2 C2.2 U$1.6(FORCE2) U$1.10(GND) U$1.15(DGND) U$1.16(GND) U$1.EXP(EP)
N$1: R1.2 R2.2 R3.2 R4.2 U$1.1(BIAS)
N$4: R1.1 R2.1 R3.1 U$1.3(REFIN–) U$1.4(ISENSOR)
N$5: R4.1 U$1.2(REFIN+)
S+: C3.1 U$1.7(RTDIN+)
SCLK: U$1.12(SCLK)
SDI: U$1.11(SDI)
SDO: U$1.14(SDO)
S–: C3.2 U$1.8(RTDIN–)
VCC: C1.1 C2.1 U$1.19(DVDD) U$1.20(VDD)
Unconnected: U$1.17(NC)

### Notes on the sheet
- The 10 M resistor is for fault
  detection if one of the RTD
  wires breaks.
- Why 3 resistors in parallel? A 400R resistor
  is not cheap, and 1.2k is a standard value
  in the E12 series. Also, the accuracy of the
  temperature is dependent on the accuracy
  of this set resistor, and 3 in parallel reduces
  the tolerance by 3x.
- NOTE TO THE ROUTER:
  Wire these as Kelvin connections
  where the REFIN pins are the
  sensing terminals!
- NOTE TO ROUTER:
  Put the following silkscreen
  text next to each pin:
  4: EXC+
  3: S+
  2: S–
  1: EXC–
- RTD Sensing Circuit
  Cooper Barry

### Library data of the parts
C1-C3 = rcl:C-EU: CAPACITOR, European symbol
R1-R4 = rcl:R-US_: RESISTOR, American symbol
U$1 = maxim:MAX31865

## Module XBEE900
Ports: +3V3(pwr) GND(pwr) XBEE_UART_OUT(out) XBEE_UART_IN(in)
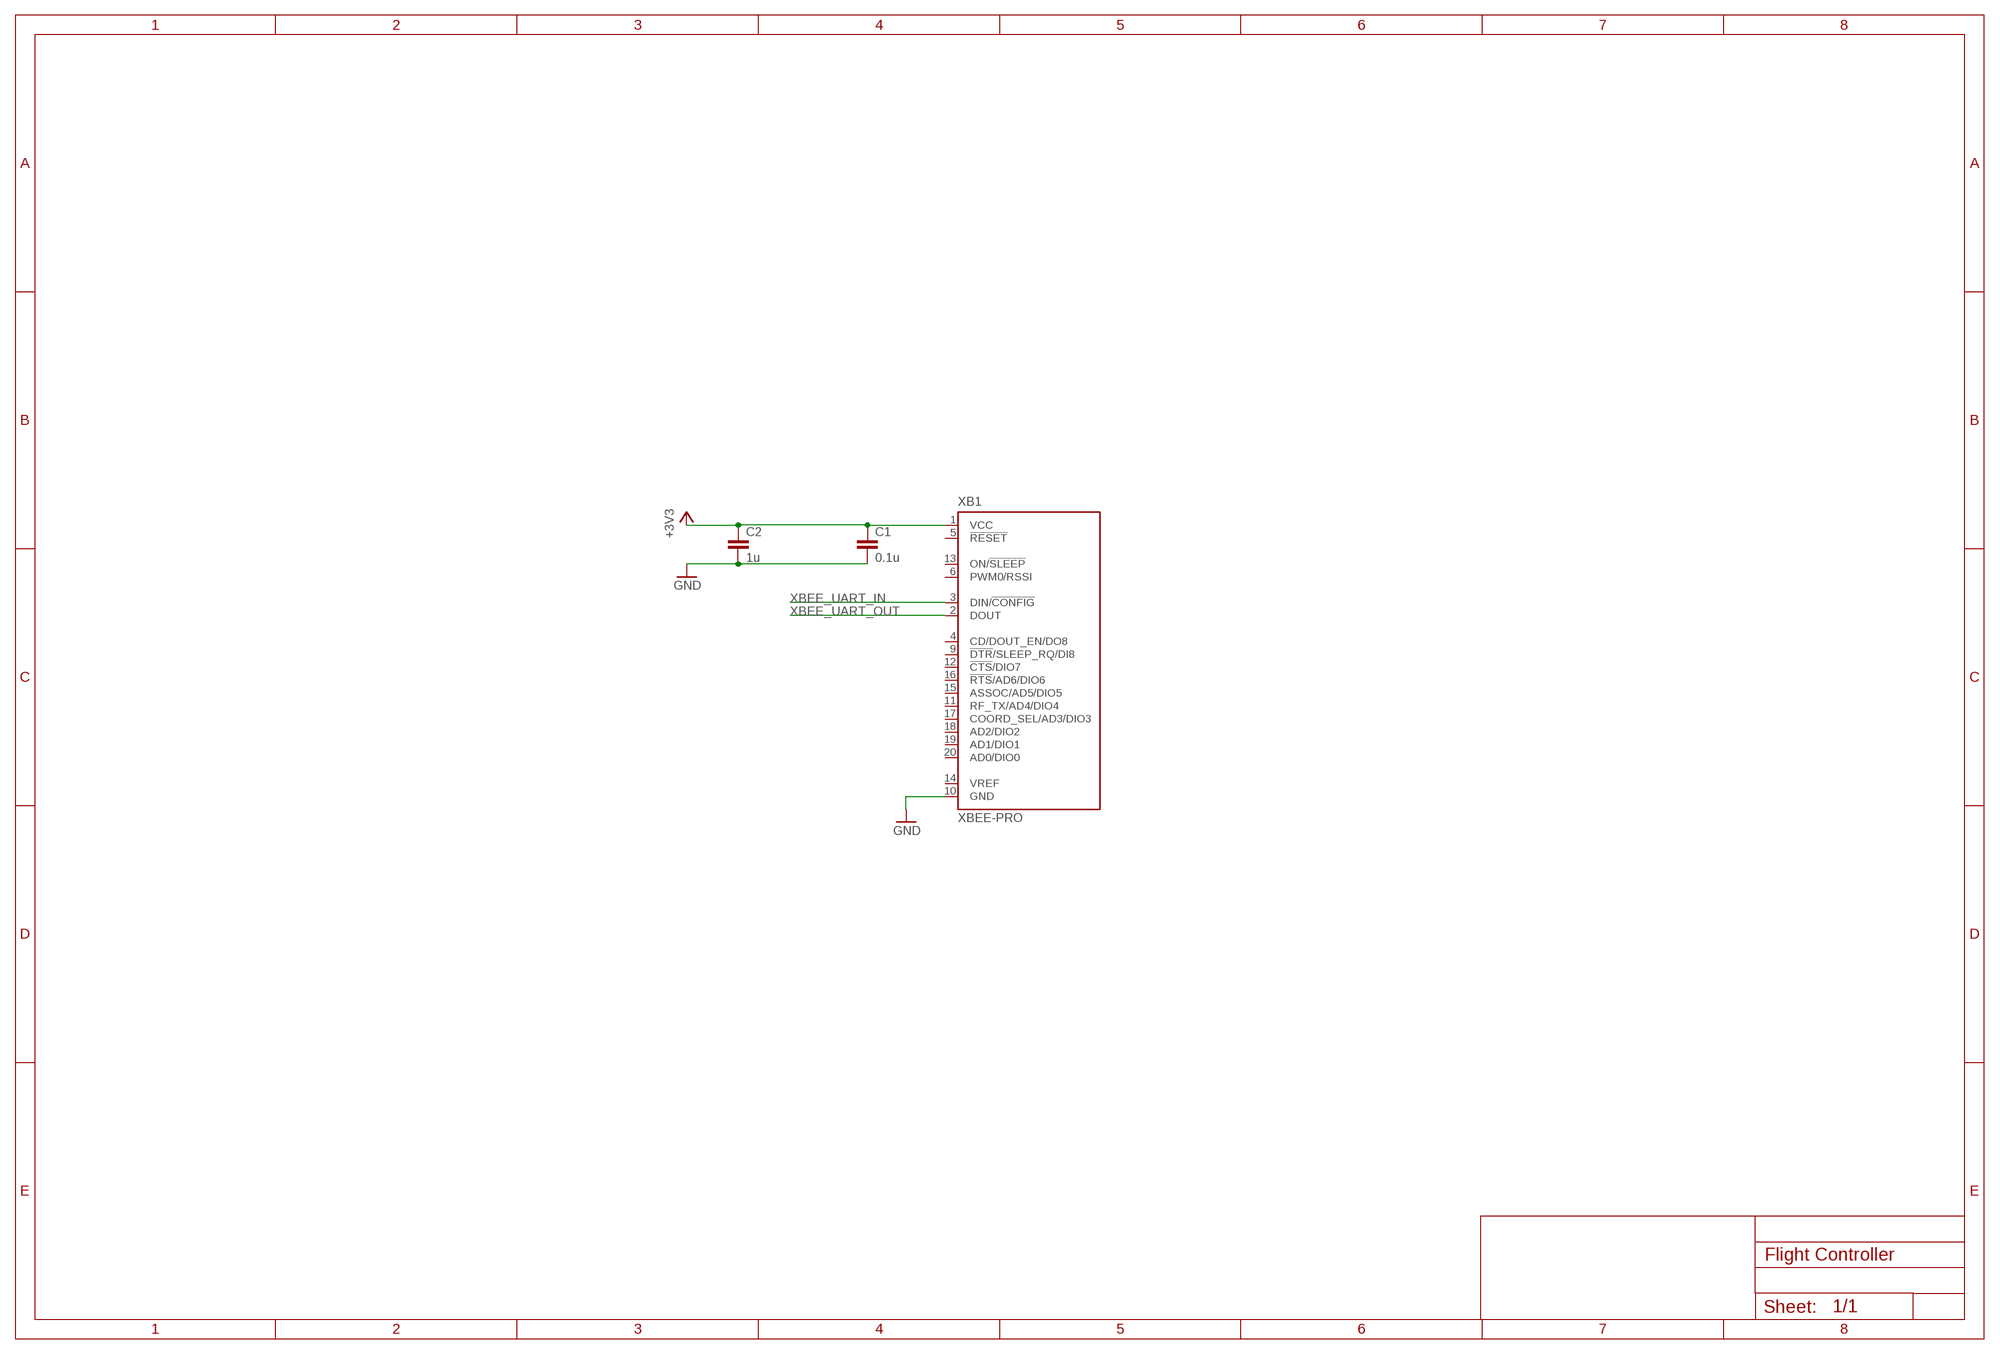
[diagram p6: schematic, module XBEE900, sheet 1]

### Parts
C1  0.1u  C-EUC0603  [C0603]
C2  1u  C-EUC0603  [C0603]
XB1  XBEE-PRO  [XBEE-PRO]

### Nets
+3V3: C1.1 C2.1 XB1.1(VCC)
GND: C1.2 C2.2 XB1.10(GND)
XBEE_UART_IN: XB1.3(DIN/!CONFIG)
XBEE_UART_OUT: XB1.2(DOUT)
Unconnected: XB1.4(CD/DOUT_EN/DO8) XB1.5(!RESET) XB1.6(PWM0/RSSI) XB1.9(!DTR!/SLEEP_RQ/DI8) XB1.11(RF_TX/AD4/DIO4) XB1.12(!CTS!/DIO7) XB1.13(ON/!SLEEP) XB1.14(VREF) XB1.15(ASSOC/AD5/DIO5) XB1.16(!RTS!/AD6/DIO6) XB1.17(COORD_SEL/AD3/DIO3) XB1.18(AD2/DIO2) XB1.19(AD1/DIO1) XB1.20(AD0/DIO0)

### Library data of the parts
C1 C2 = rcl:C-EU: CAPACITOR, European symbol
XB1 = maxstream:XBEE: XBee (TM) /XBee-PRO(TM) OEM RF Modules Source: MaxStream, Inc. xbee_productmanual.pdf; MPN: XBP24-AWI-001; OC_FARNELL: 1337916; OC_NEWARK: 42M2667

## Module MEMORY
Ports: MEM_SCK(in) MEM_CS(in) MEM_MISO(io) MEM_MOSI(io) +3V3(pwr) GND(pwr)
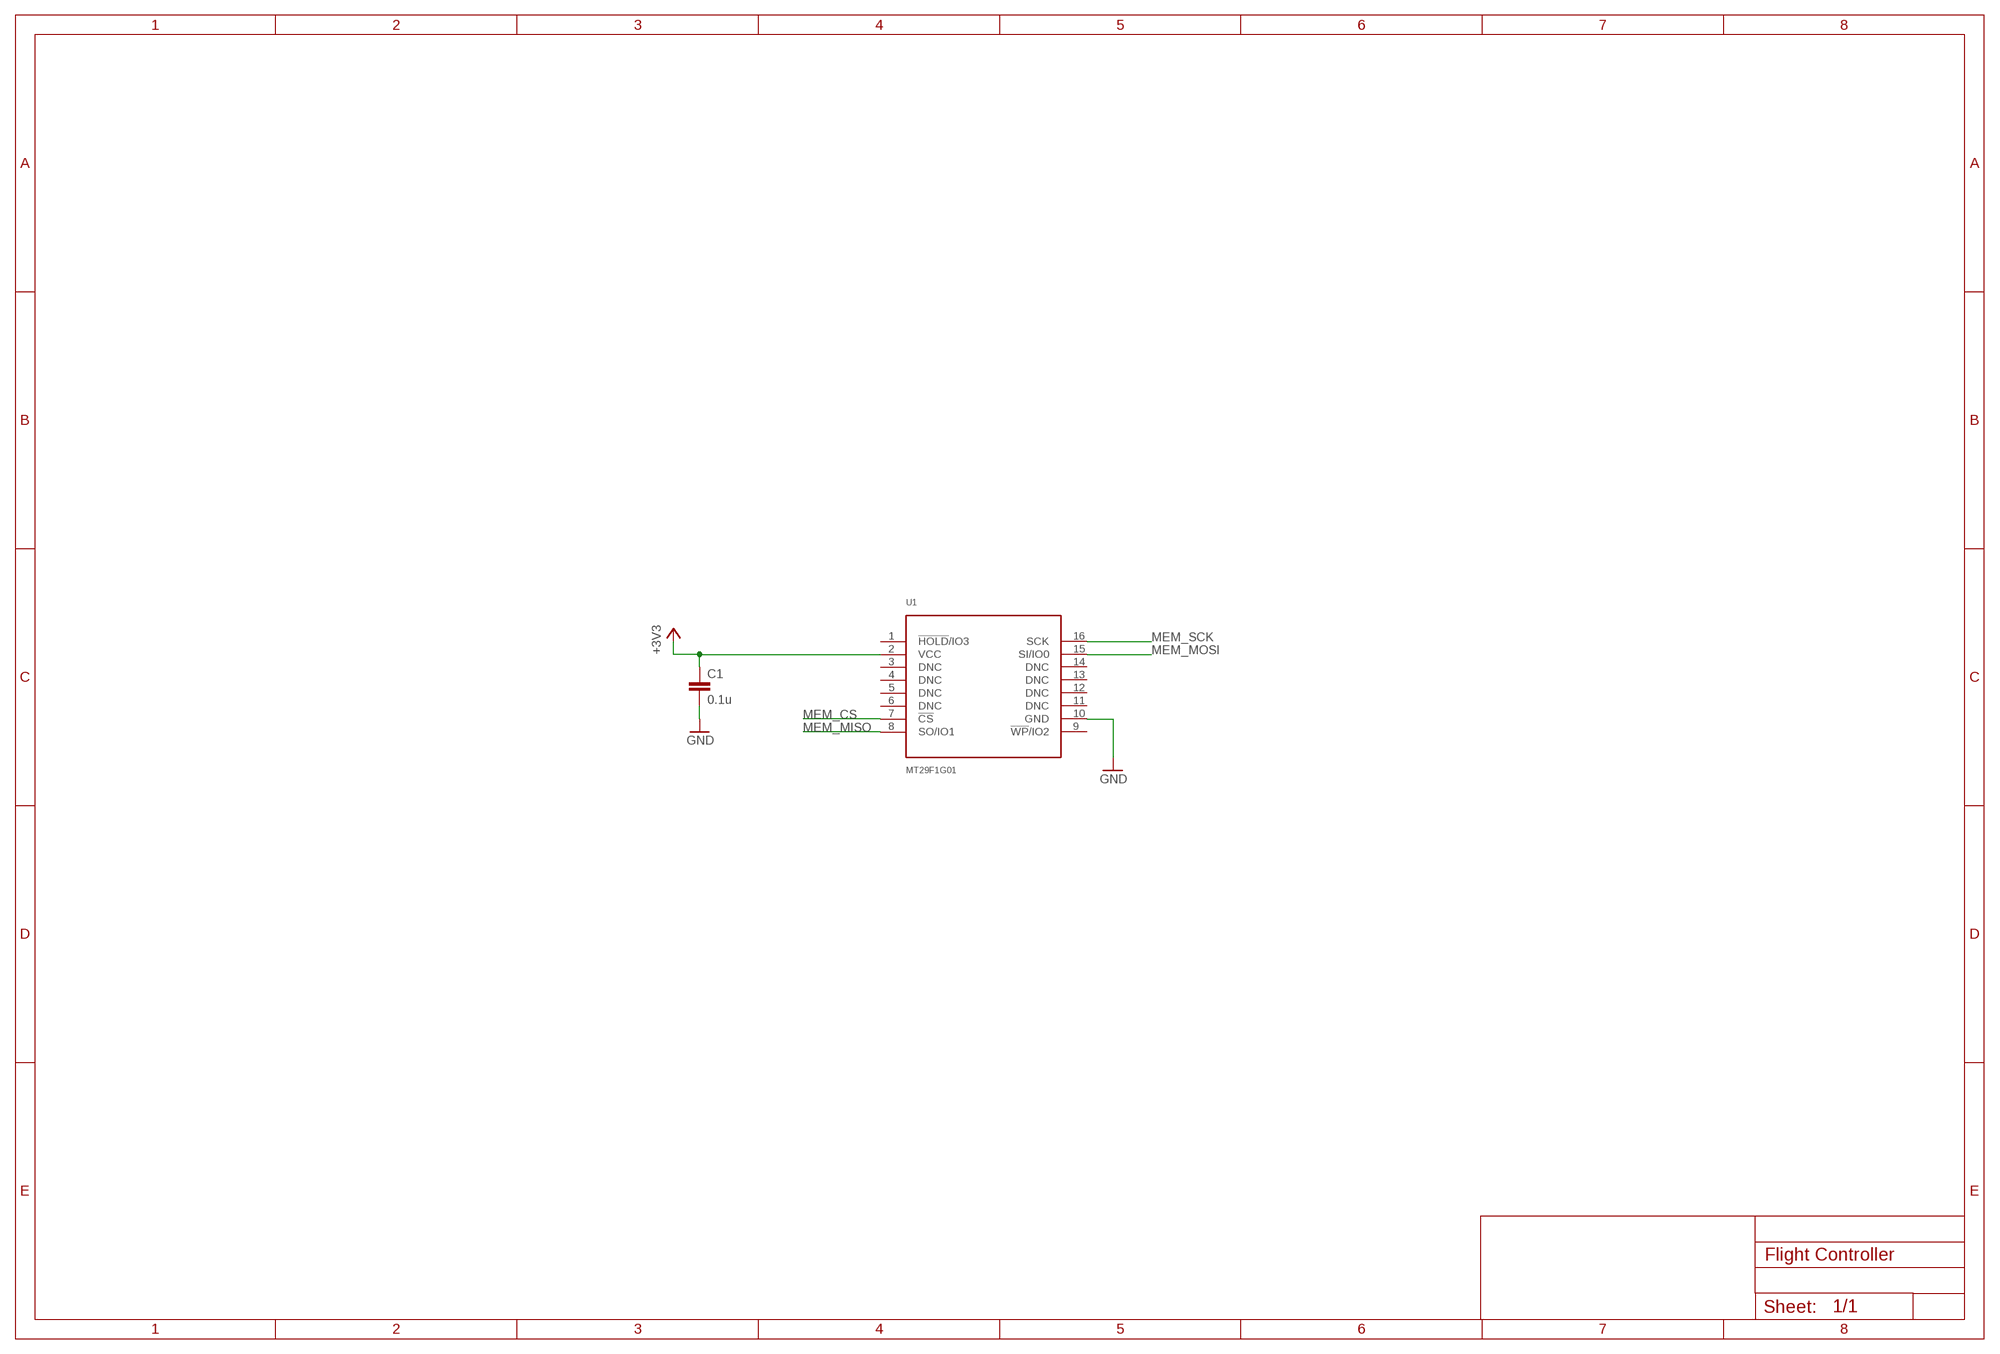
[diagram p7: schematic, module MEMORY, sheet 1]

### Parts
C1  0.1u  C-EUC0603  [C0603]
U1  MT29F1G01  [SOP16]

### Nets
+3V3: C1.1 U1.2(VCC)
GND: C1.2 U1.10(GND)
MEM_CS: U1.7(!CS)
MEM_MISO: U1.8(SO/IO1)
MEM_MOSI: U1.15(SI/IO0)
MEM_SCK: U1.16(SCK)
Unconnected: U1.1(!HOLD!/IO3) U1.3(DNC) U1.4(DNC) U1.5(DNC) U1.6(DNC) U1.9(!WP!/IO2) U1.11(DNC) U1.12(DNC) U1.13(DNC) U1.14(DNC)

### Library data of the parts
C1 = rcl:C-EU: CAPACITOR, European symbol
U1 = micron:MT29F1G01

## Module GPS
Ports: GPS_RX(in) GPS_TX(out) GND(pwr) +3V3(pwr)
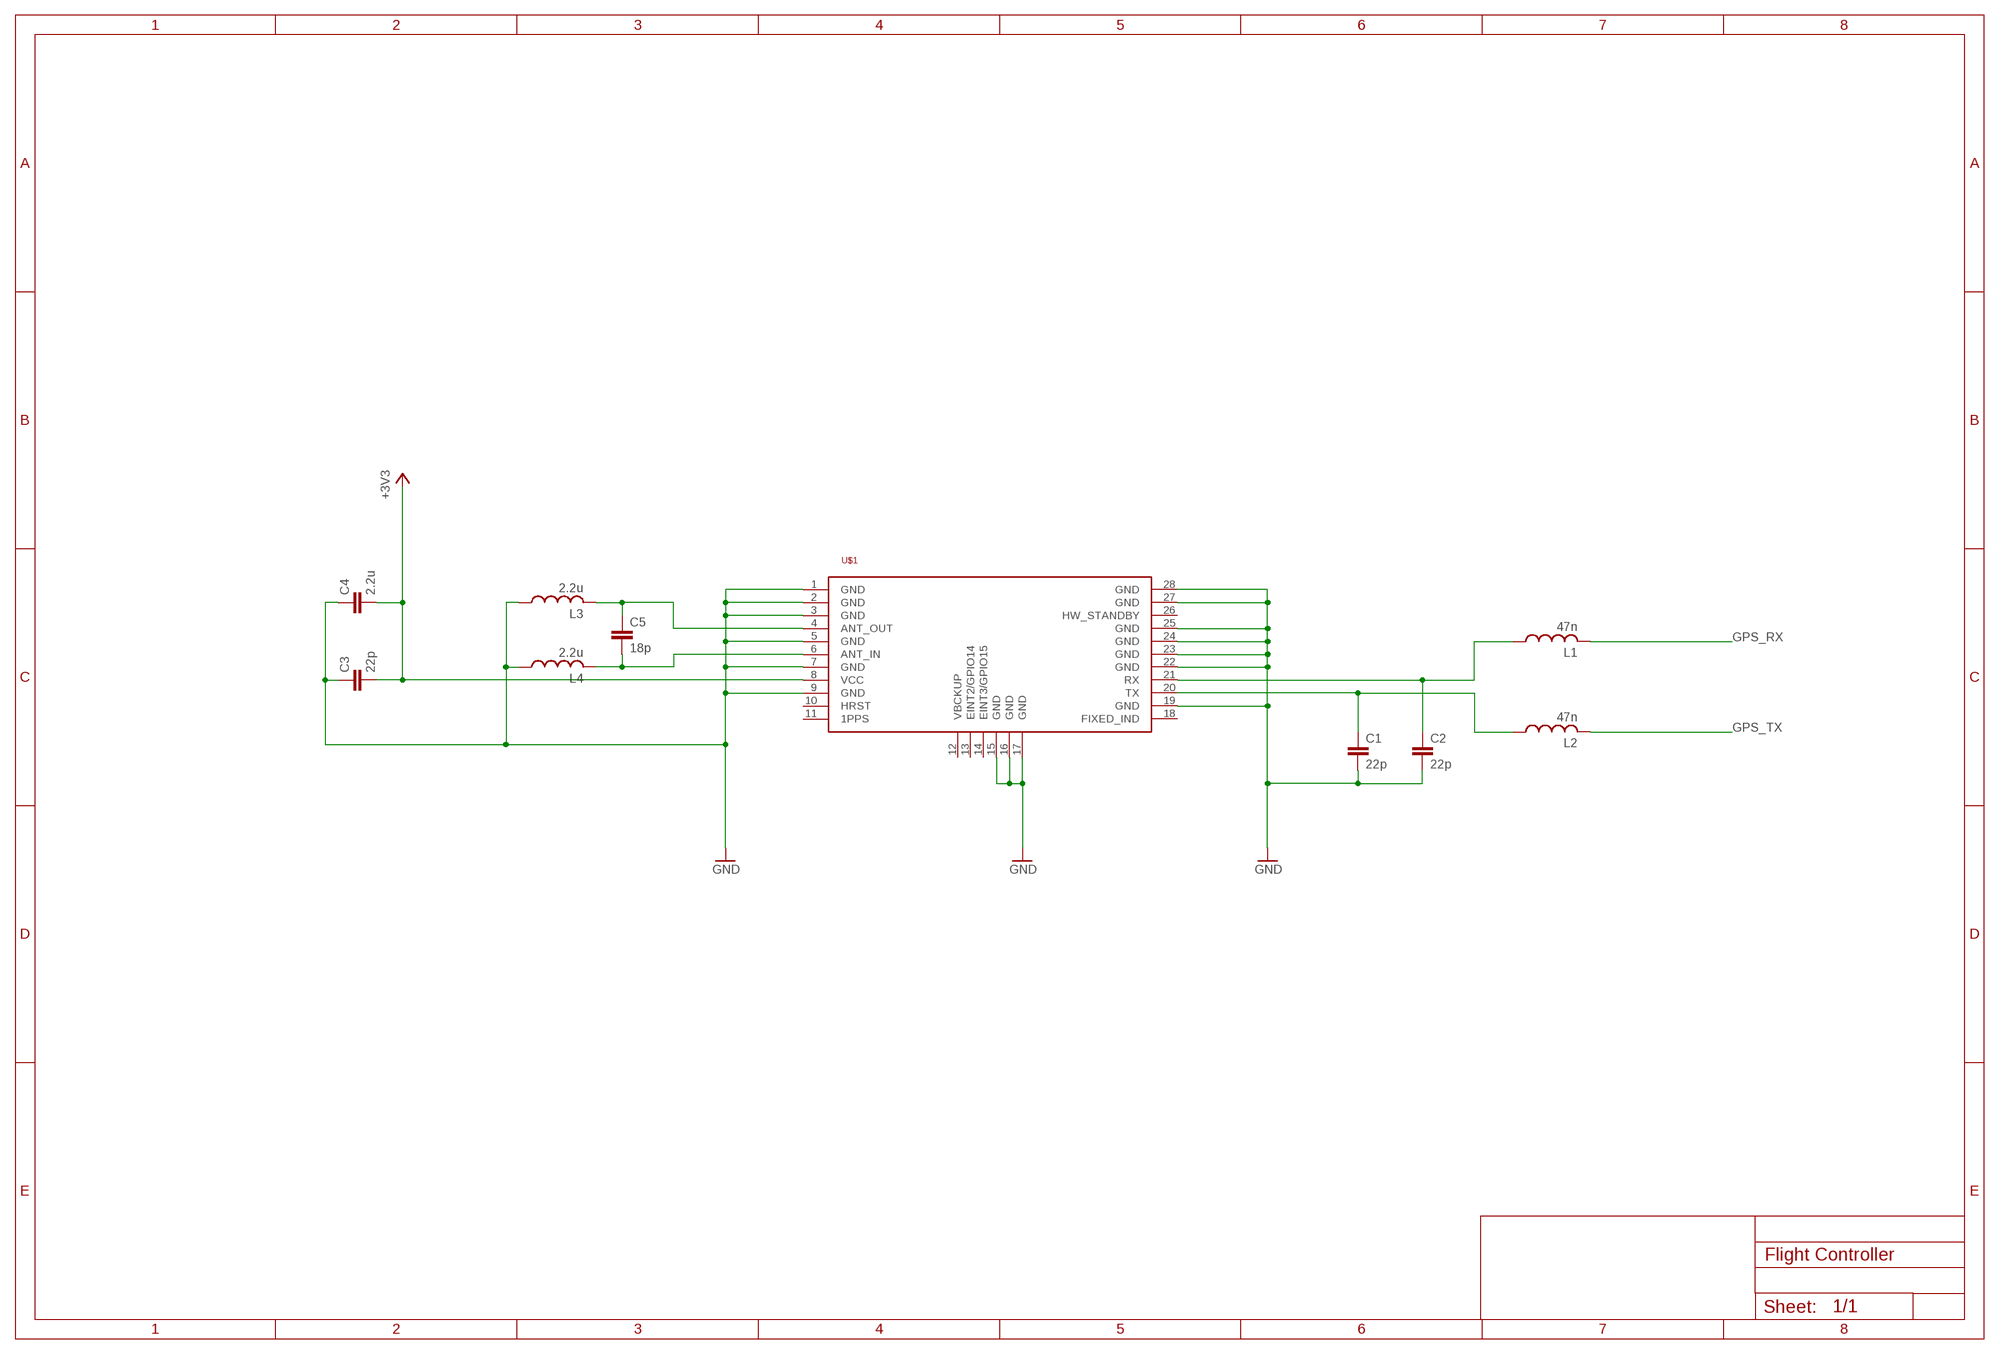
[diagram p8: schematic, module GPS, sheet 1]

### Parts
C1  22p  C-EUC0603  [C0603]
C2  22p  C-EUC0603  [C0603]
C3  22p  C-EUC0603  [C0603]
C4  2.2u  C-EUC0603  [C0603]
C5  18p  C-EUC0603  [C0603]
L1  47n  L-US0603  [R0805]
L2  47n  L-US0603  [R0805]
L3  2.2u  L-US0603  [R0805]
L4  2.2u  L-US0603  [R0805]
U$1  M10478-A3  [M10478-A3]

### Nets
+3V3: C3.2 C4.2 U$1.8(VCC)
GND: C1.2 C2.2 C3.1 C4.1 L3.1 L4.1 U$1.1(GND) U$1.2(GND) U$1.3(GND) U$1.5(GND) U$1.7(GND) U$1.9(GND) U$1.15(GND) U$1.16(GND) U$1.17(GND) U$1.19(GND) U$1.22(GND) U$1.23(GND) U$1.24(GND) U$1.25(GND) U$1.27(GND) U$1.28(GND)
GPS_RX: L1.2
GPS_TX: L2.2
N$1: C5.1 L3.2 U$1.4(ANT_OUT)
N$2: C2.1 L1.1 U$1.21(RX)
N$3: C1.1 L2.1 U$1.20(TX)
N$4: C5.2 L4.2 U$1.6(ANT_IN)
Unconnected: U$1.10(HRST) U$1.11(1PPS) U$1.12(VBCKUP) U$1.13(EINT2/GPIO14) U$1.14(EINT3/GPIO15) U$1.18(FIXED_IND) U$1.26(HW_STANDBY)

### Library data of the parts
C1-C5 = rcl:C-EU: CAPACITOR, European symbol
L1-L4 = rcl:L-US: INDUCTOR, American symbol
U$1 = Antenova:M10478-A3

## Module BREAKWIRE
Ports: GND(pwr) BW+(io) BW_STAT/BW–(io) +3V3(pwr)
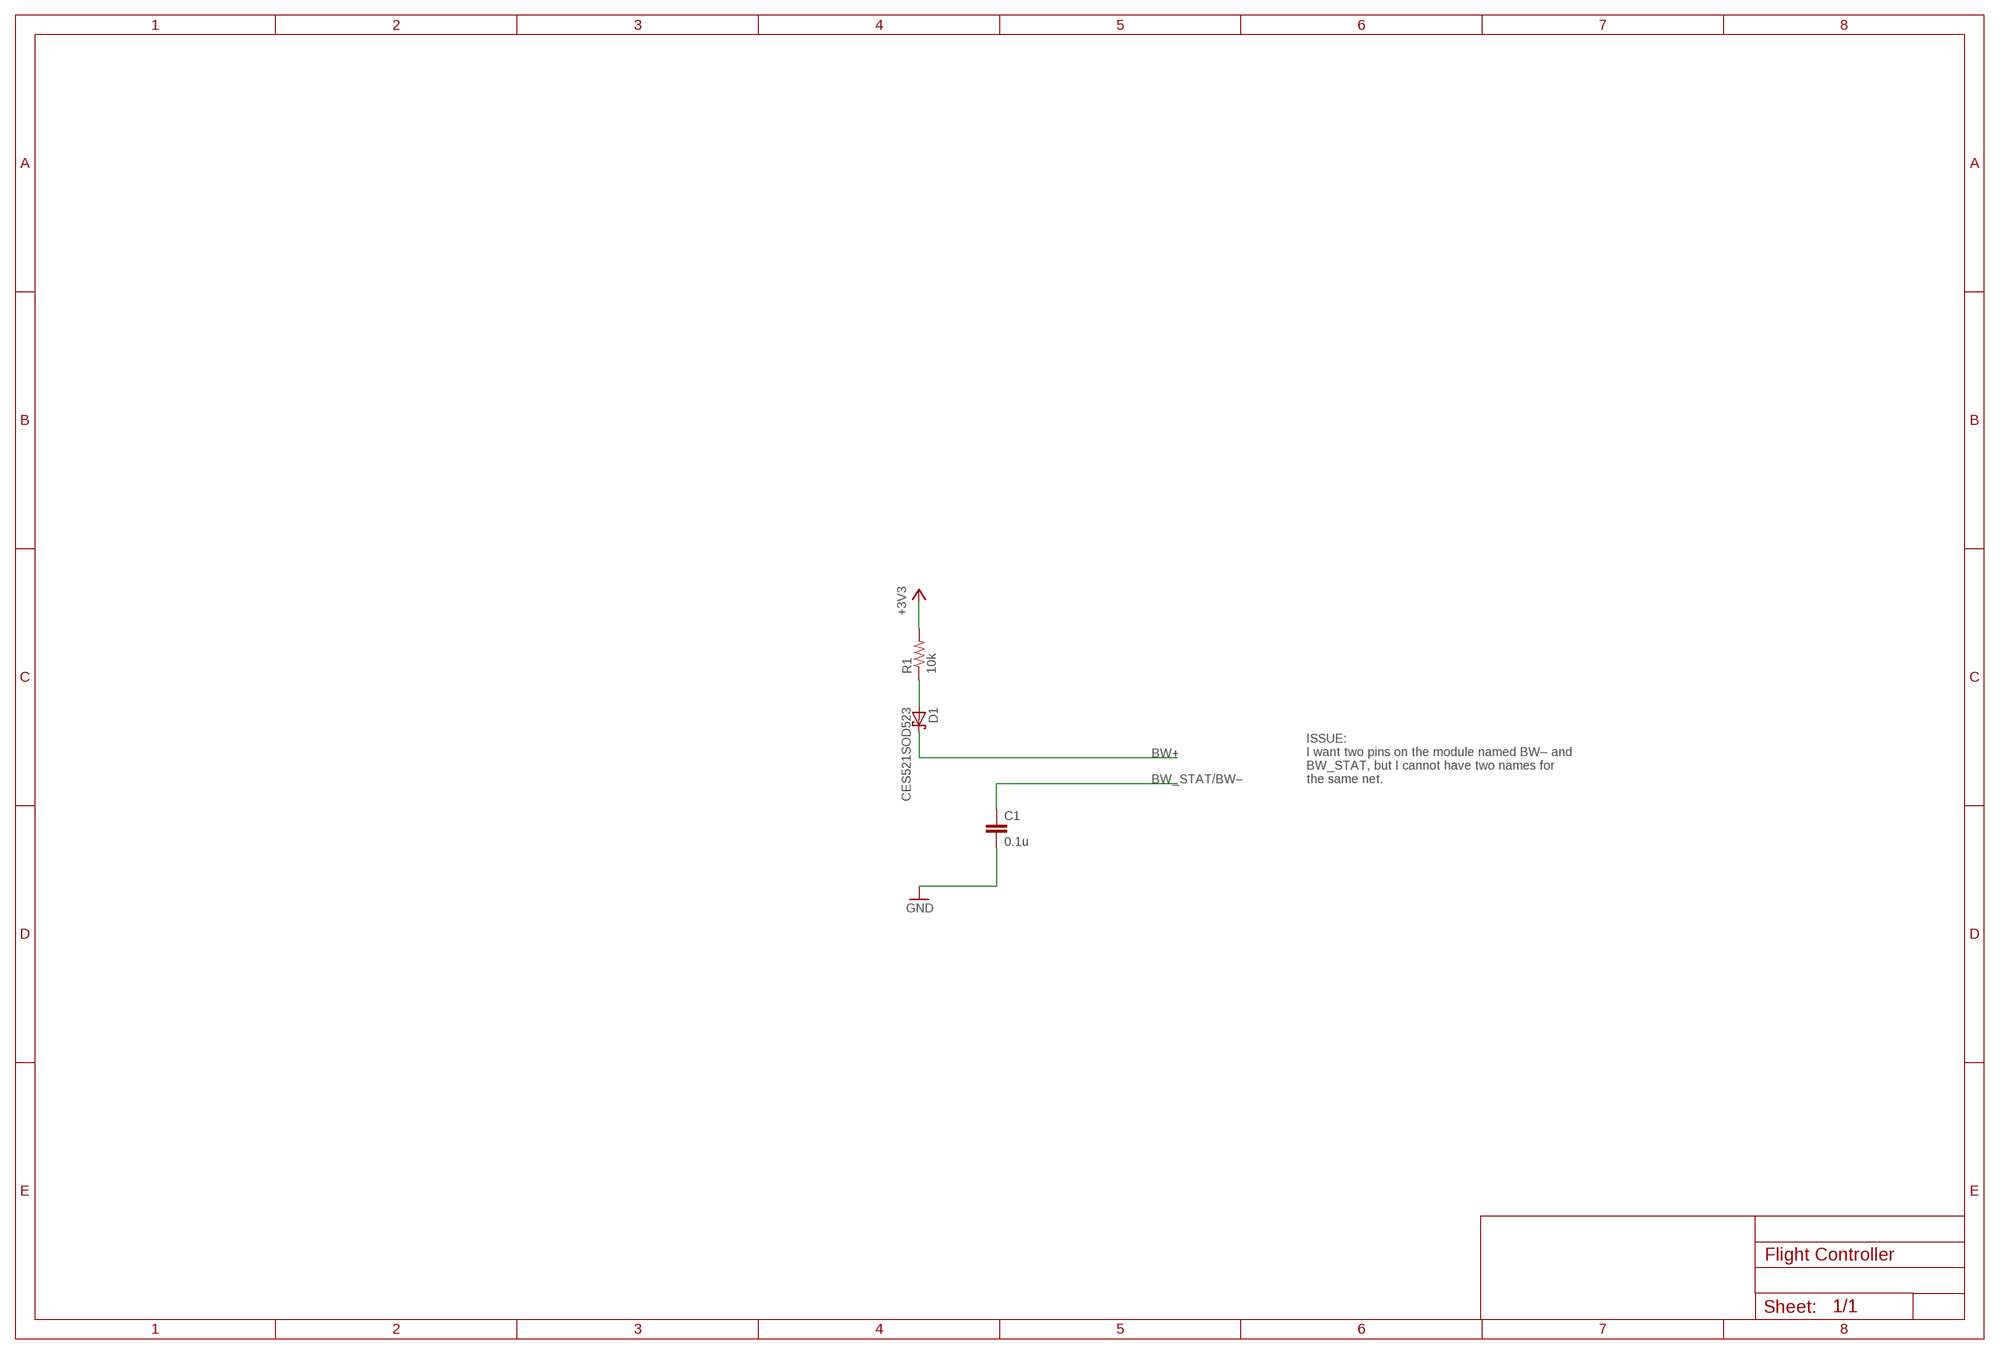
[diagram p9: schematic, module BREAKWIRE, sheet 1]

### Parts
C1  0.1u  C-EUC0603  [C0603]
D1  CES521SOD523  [SOD523]
R1  10k  R-US_R0603  [R0603]

### Nets
+3V3: R1.2
BW+: D1.C
BW_STAT/BW–: C1.1
GND: C1.2
N$1: D1.A R1.1

### Notes on the sheet
- ISSUE:
  I want two pins on the module named BW– and
  BW_STAT, but I cannot have two names for
  the same net.

### Library data of the parts
C1 = rcl:C-EU: CAPACITOR, European symbol
D1 = diode:CES521
R1 = rcl:R-US_: RESISTOR, American symbol

## Module IMU
Ports: GND(pwr) SDA(io) SCL(in) AD0(io) INT(io) +3V3(pwr)
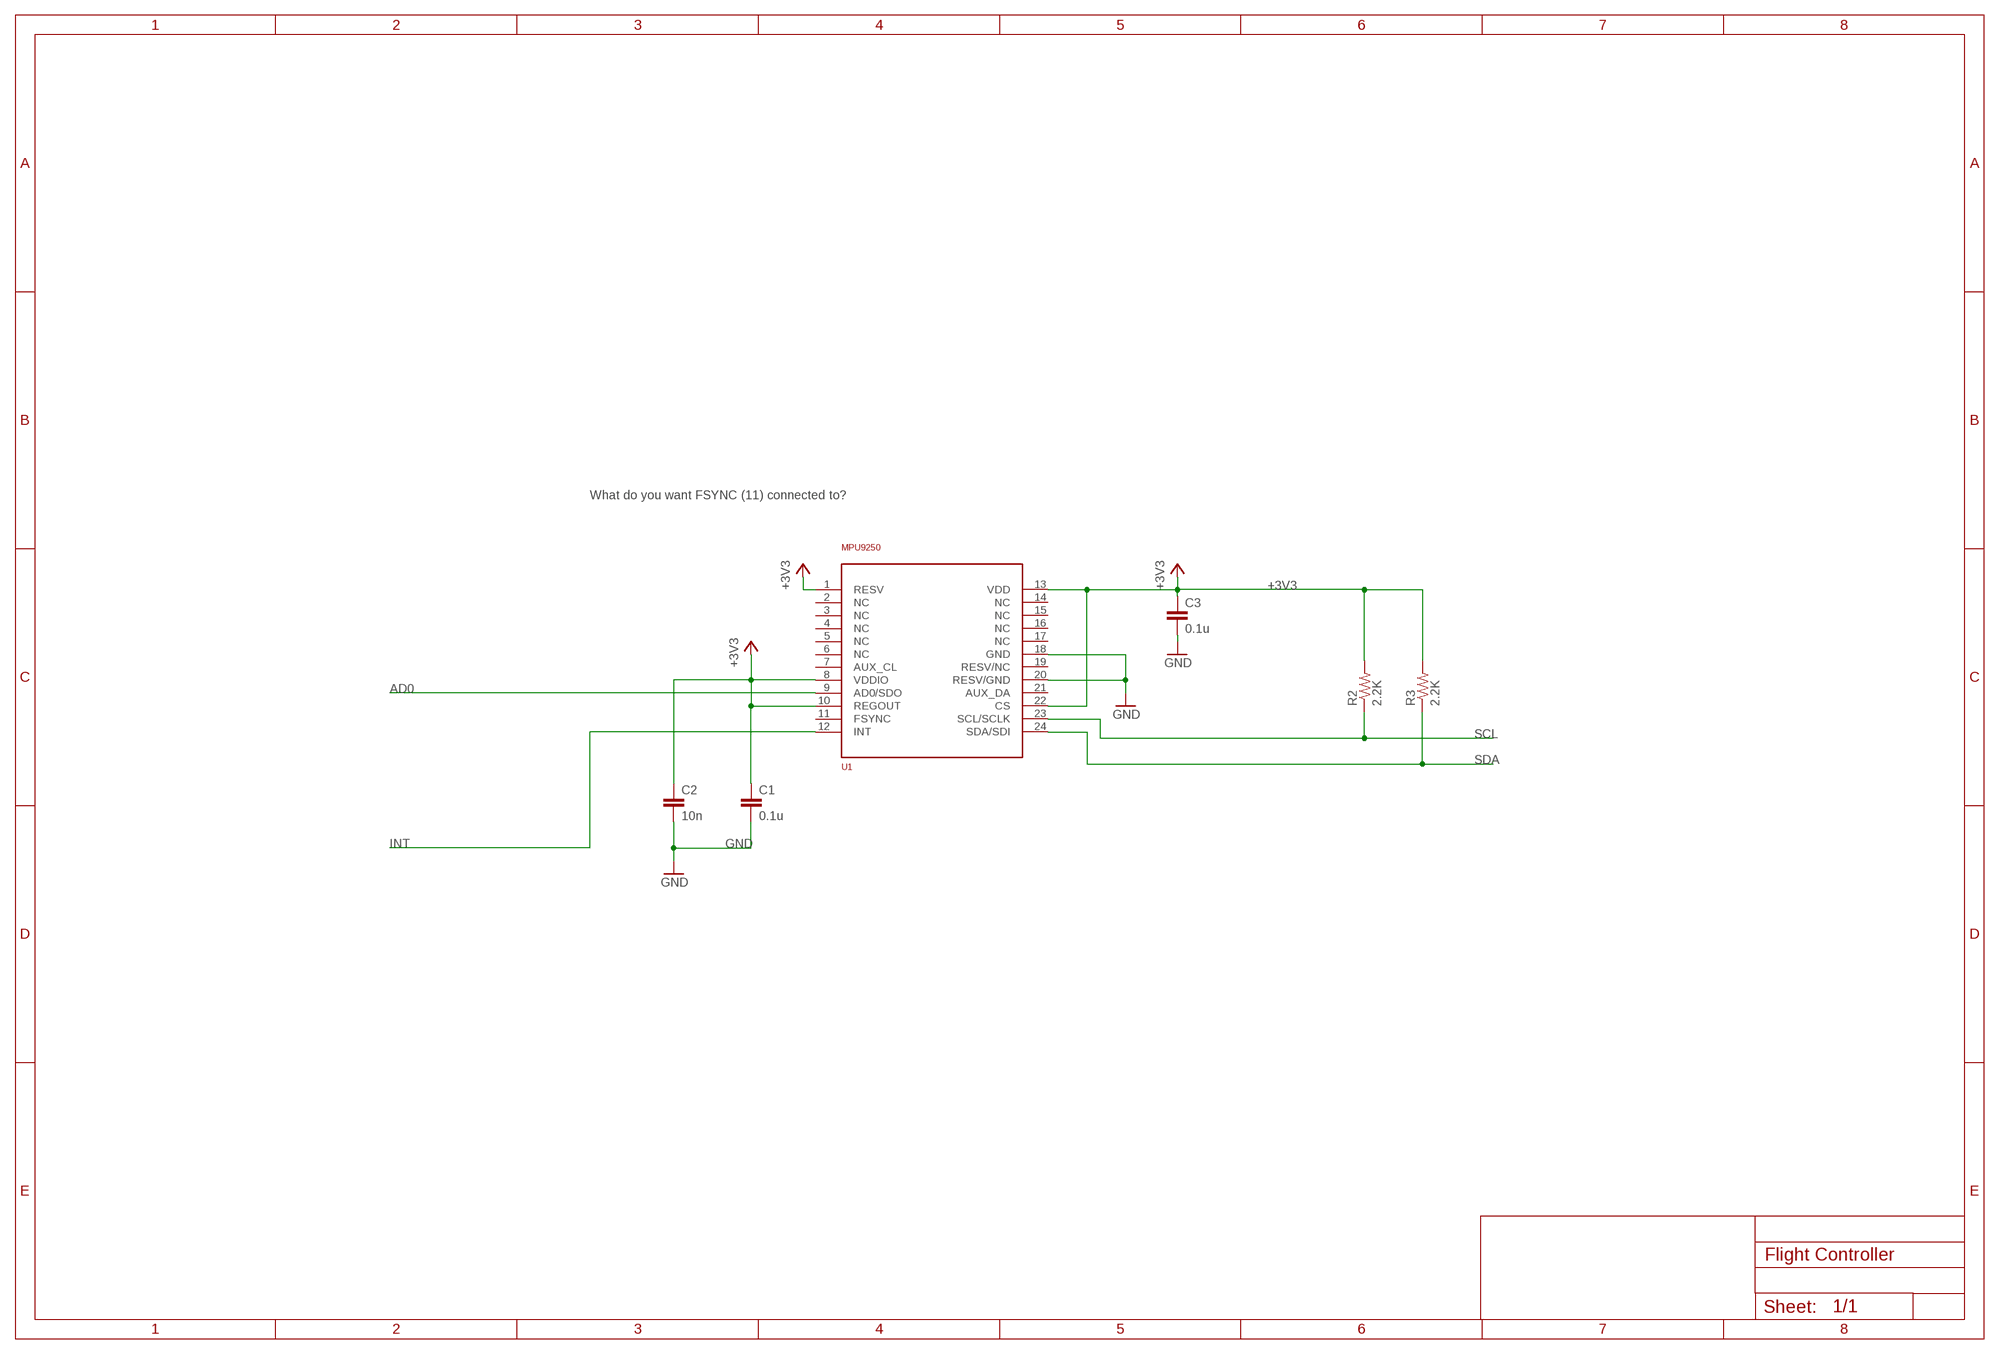
[diagram p10: schematic, module IMU, sheet 1]

### Parts
C1  0.1u  C-EUC0603  [C0603]
C2  10n  C-EUC0603  [C0603]
C3  0.1u  C-EUC0603  [C0603]
R2  2.2K  R-US_R0603  [R0603]
R3  2.2K  R-US_R0603  [R0603]
U1  MPU9250  MPU-9250  [QFN-24]

### Nets
+3V3: C1.1 C2.1 C3.1 R2.2 R3.2 U1.1(RESV) U1.8(VDDIO) U1.10(REGOUT) U1.13(VDD) U1.22(CS)
AD0: U1.9(AD0/SDO)
GND: C1.2 C2.2 C3.2 U1.18(GND) U1.20(RESV/GND)
INT: U1.12(INT)
SCL: R2.1 U1.23(SCL/SCLK)
SDA: R3.1 U1.24(SDA/SDI)
Unconnected: U1.2(NC) U1.3(NC) U1.4(NC) U1.5(NC) U1.6(NC) U1.7(AUX_CL) U1.11(FSYNC) U1.14(NC) U1.15(NC) U1.16(NC) U1.17(NC) U1.19(RESV/NC) U1.21(AUX_DA)

### Notes on the sheet
- What do you want FSYNC (11) connected to?

### Library data of the parts
C1-C3 = rcl:C-EU: CAPACITOR, European symbol
R2 R3 = rcl:R-US_: RESISTOR, American symbol
U1 = InvenSense:MPU-9250

## Module HIGH_G
Ports: GND(pwr) SCL/SPC(in) SDA/SDI(io) SA0/SDO(io) CS(in) INT1(out) INT2(out) +3V3(pwr)
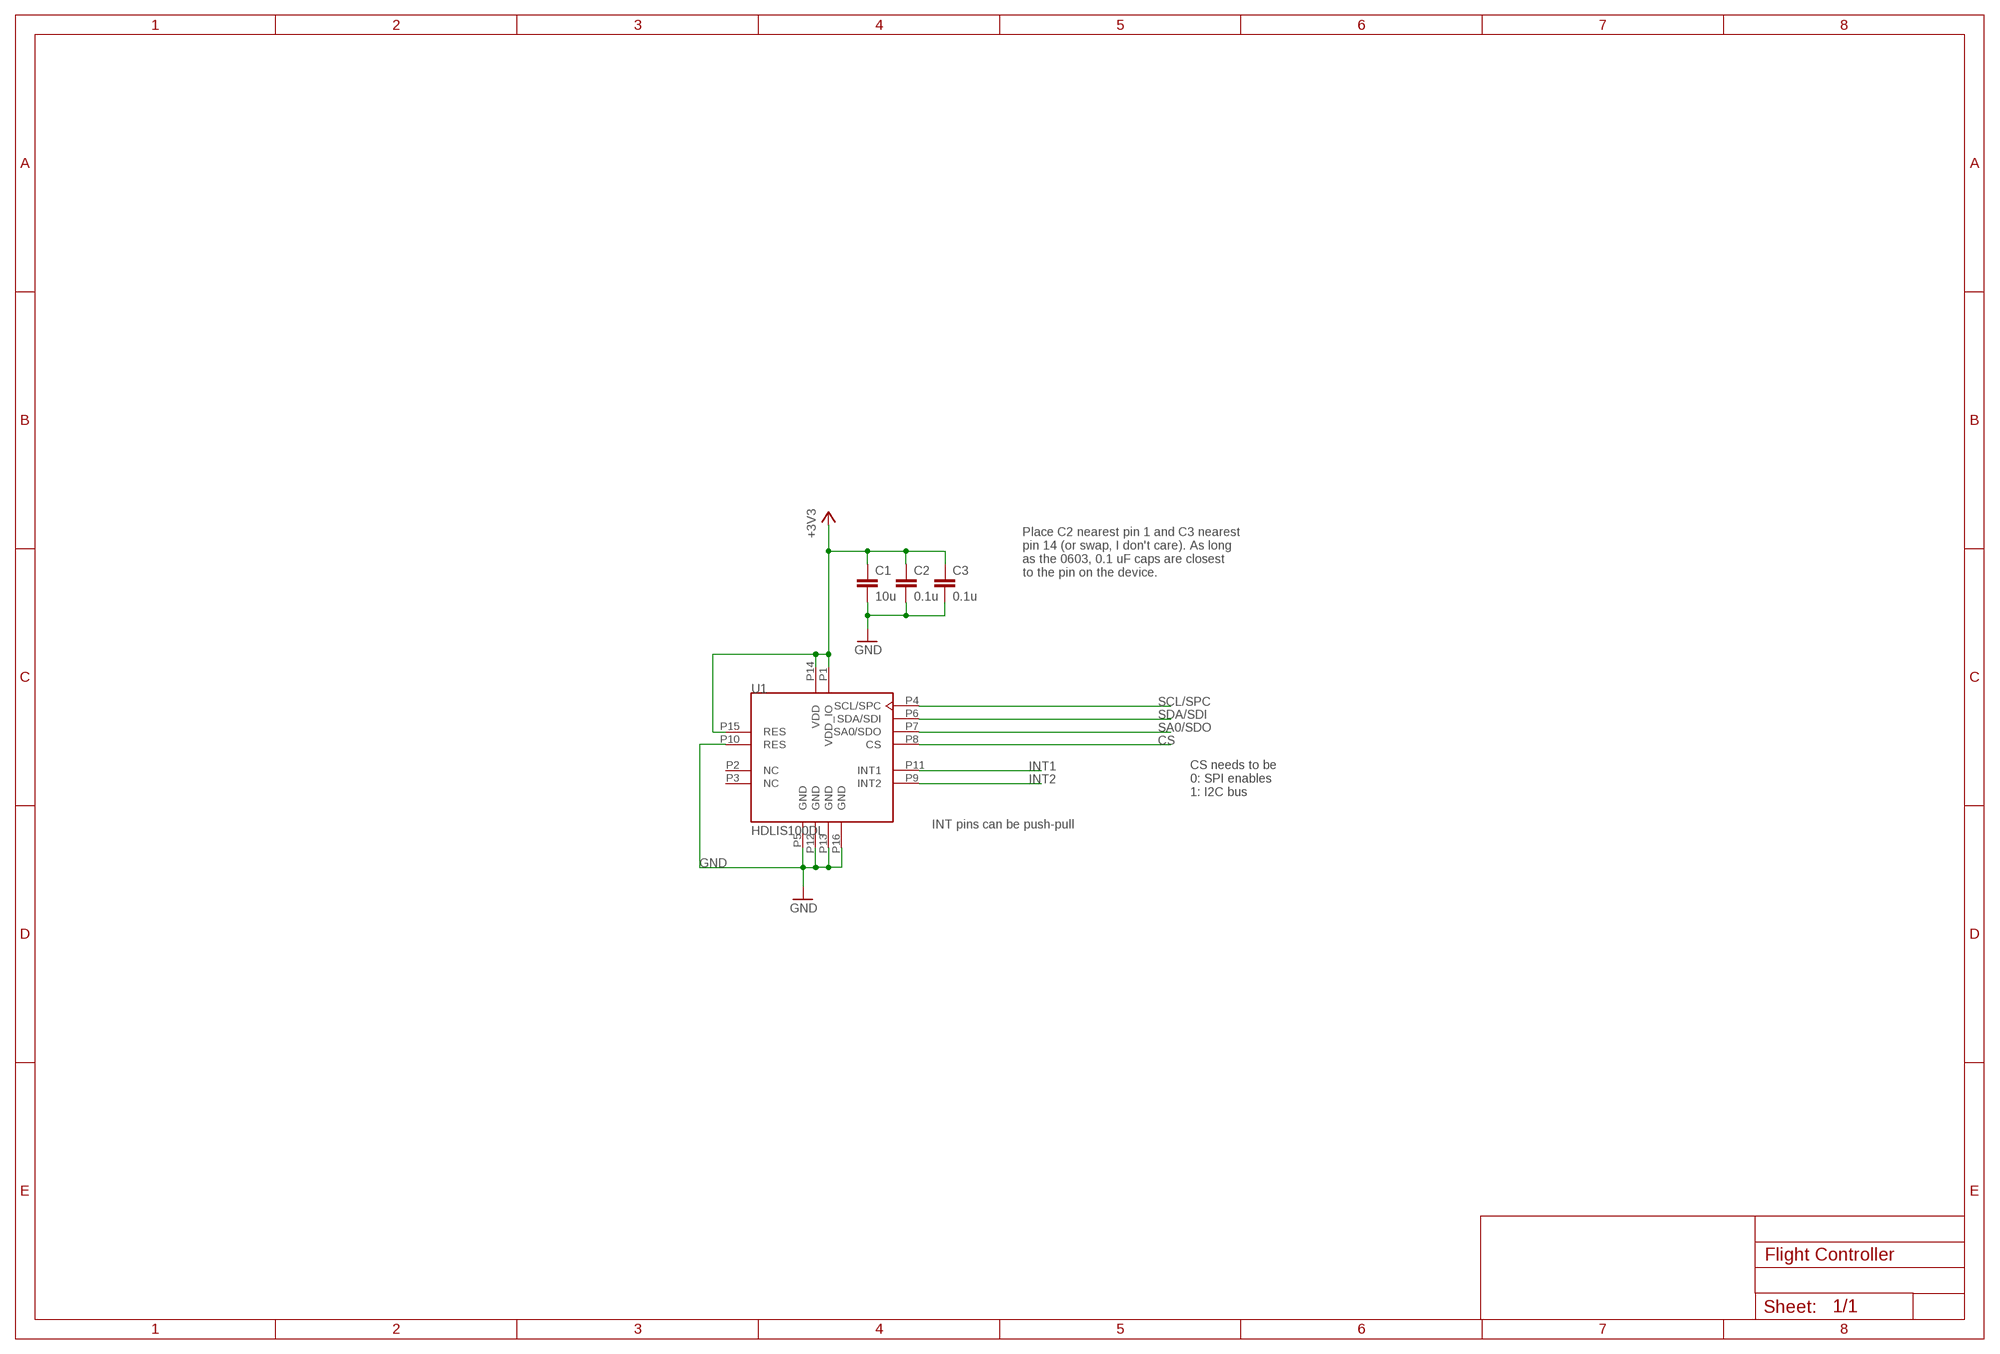
[diagram p11: schematic, module HIGH_G, sheet 1]

### Parts
C1  10u  C-EUC0805  [C0805]
C2  0.1u  C-EUC0603  [C0603]
C3  0.1u  C-EUC0603  [C0603]
U1  HDLIS100DL  [TFLGA16L]

### Nets
+3V3: C1.1 C2.1 C3.1 U1.P1(VDD_IO) U1.P14(VDD) U1.P15(RES)
CS: U1.P8(CS)
GND: C1.2 C2.2 C3.2 U1.P5(GND) U1.P10(RES) U1.P12(GND) U1.P13(GND) U1.P16(GND)
INT1: U1.P11(INT1)
INT2: U1.P9(INT2)
SA0/SDO: U1.P7(SA0/SDO)
SCL/SPC: U1.P4(SCL/SPC)
SDA/SDI: U1.P6(SDA/SDI)
Unconnected: U1.P2(NC) U1.P3(NC)

### Notes on the sheet
- Place C2 nearest pin 1 and C3 nearest
  pin 14 (or swap, I don't care). As long
  as the 0603, 0.1 uF caps are closest
  to the pin on the device.
- CS needs to be
  0: SPI enables
  1: I2C bus
- INT pins can be push-pull

### Library data of the parts
C1-C3 = rcl:C-EU: CAPACITOR, European symbol
U1 = st-microelectronics:HDLIS100DL

## Module MS5611
Ports: SDA(io) +3V3(pwr) GND(pwr) SCL/SCLK(in)
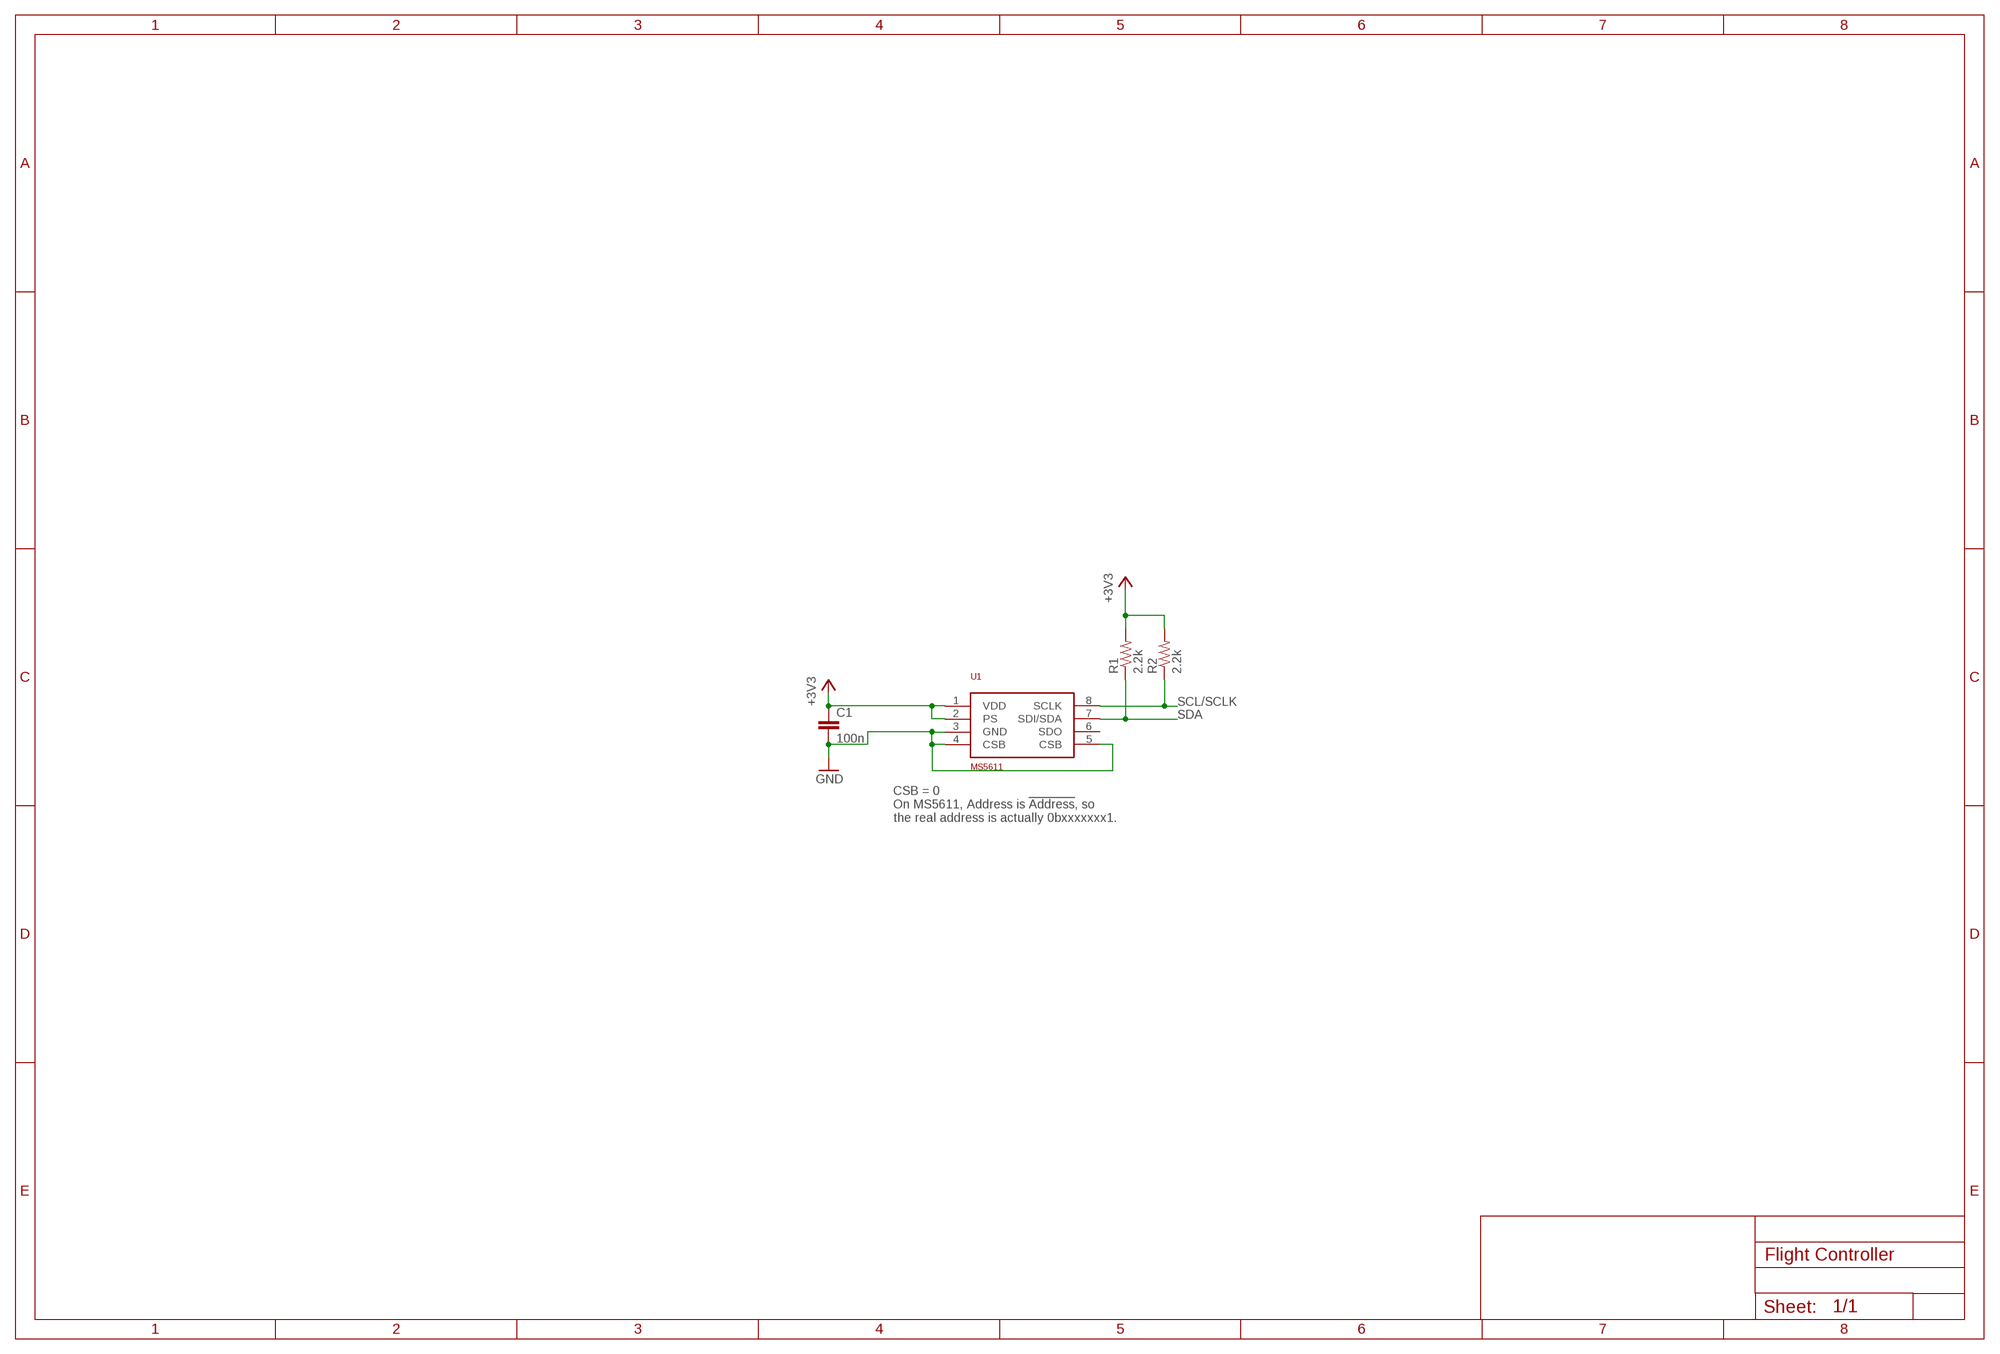
[diagram p12: schematic, module MS5611, sheet 1]

### Parts
C1  100n  C-EUC0603  [C0603]
R1  2.2k  R-US_R0603  [R0603]
R2  2.2k  R-US_R0603  [R0603]
U1  MS5611  [MS5611]

### Nets
+3V3: C1.1 R1.2 R2.2 U1.1(VDD) U1.2(PS)
GND: C1.2 U1.3(GND) U1.4(CSB) U1.5(CSB)
SCL/SCLK: R2.1 U1.8(SCLK)
SDA: R1.1 U1.7(SDI/SDA)
Unconnected: U1.6(SDO)

### Notes on the sheet
- CSB = 0
  On MS5611, Address is !Address, so
  the real address is actually 0bxxxxxxx1.

### Library data of the parts
C1 = resistor:C-EU: CAPACITOR, European symbol
R1 R2 = rcl:R-US_: RESISTOR, American symbol
U1 = Measurement Specialties:MS5611: MS5611 Pressure Sensor from SEAS Switzerland.

## Module FTDI
Ports: +5V(pwr) GND(pwr) USB_P(io) USB_N(io) USB_TX(io) USB_RX(io)
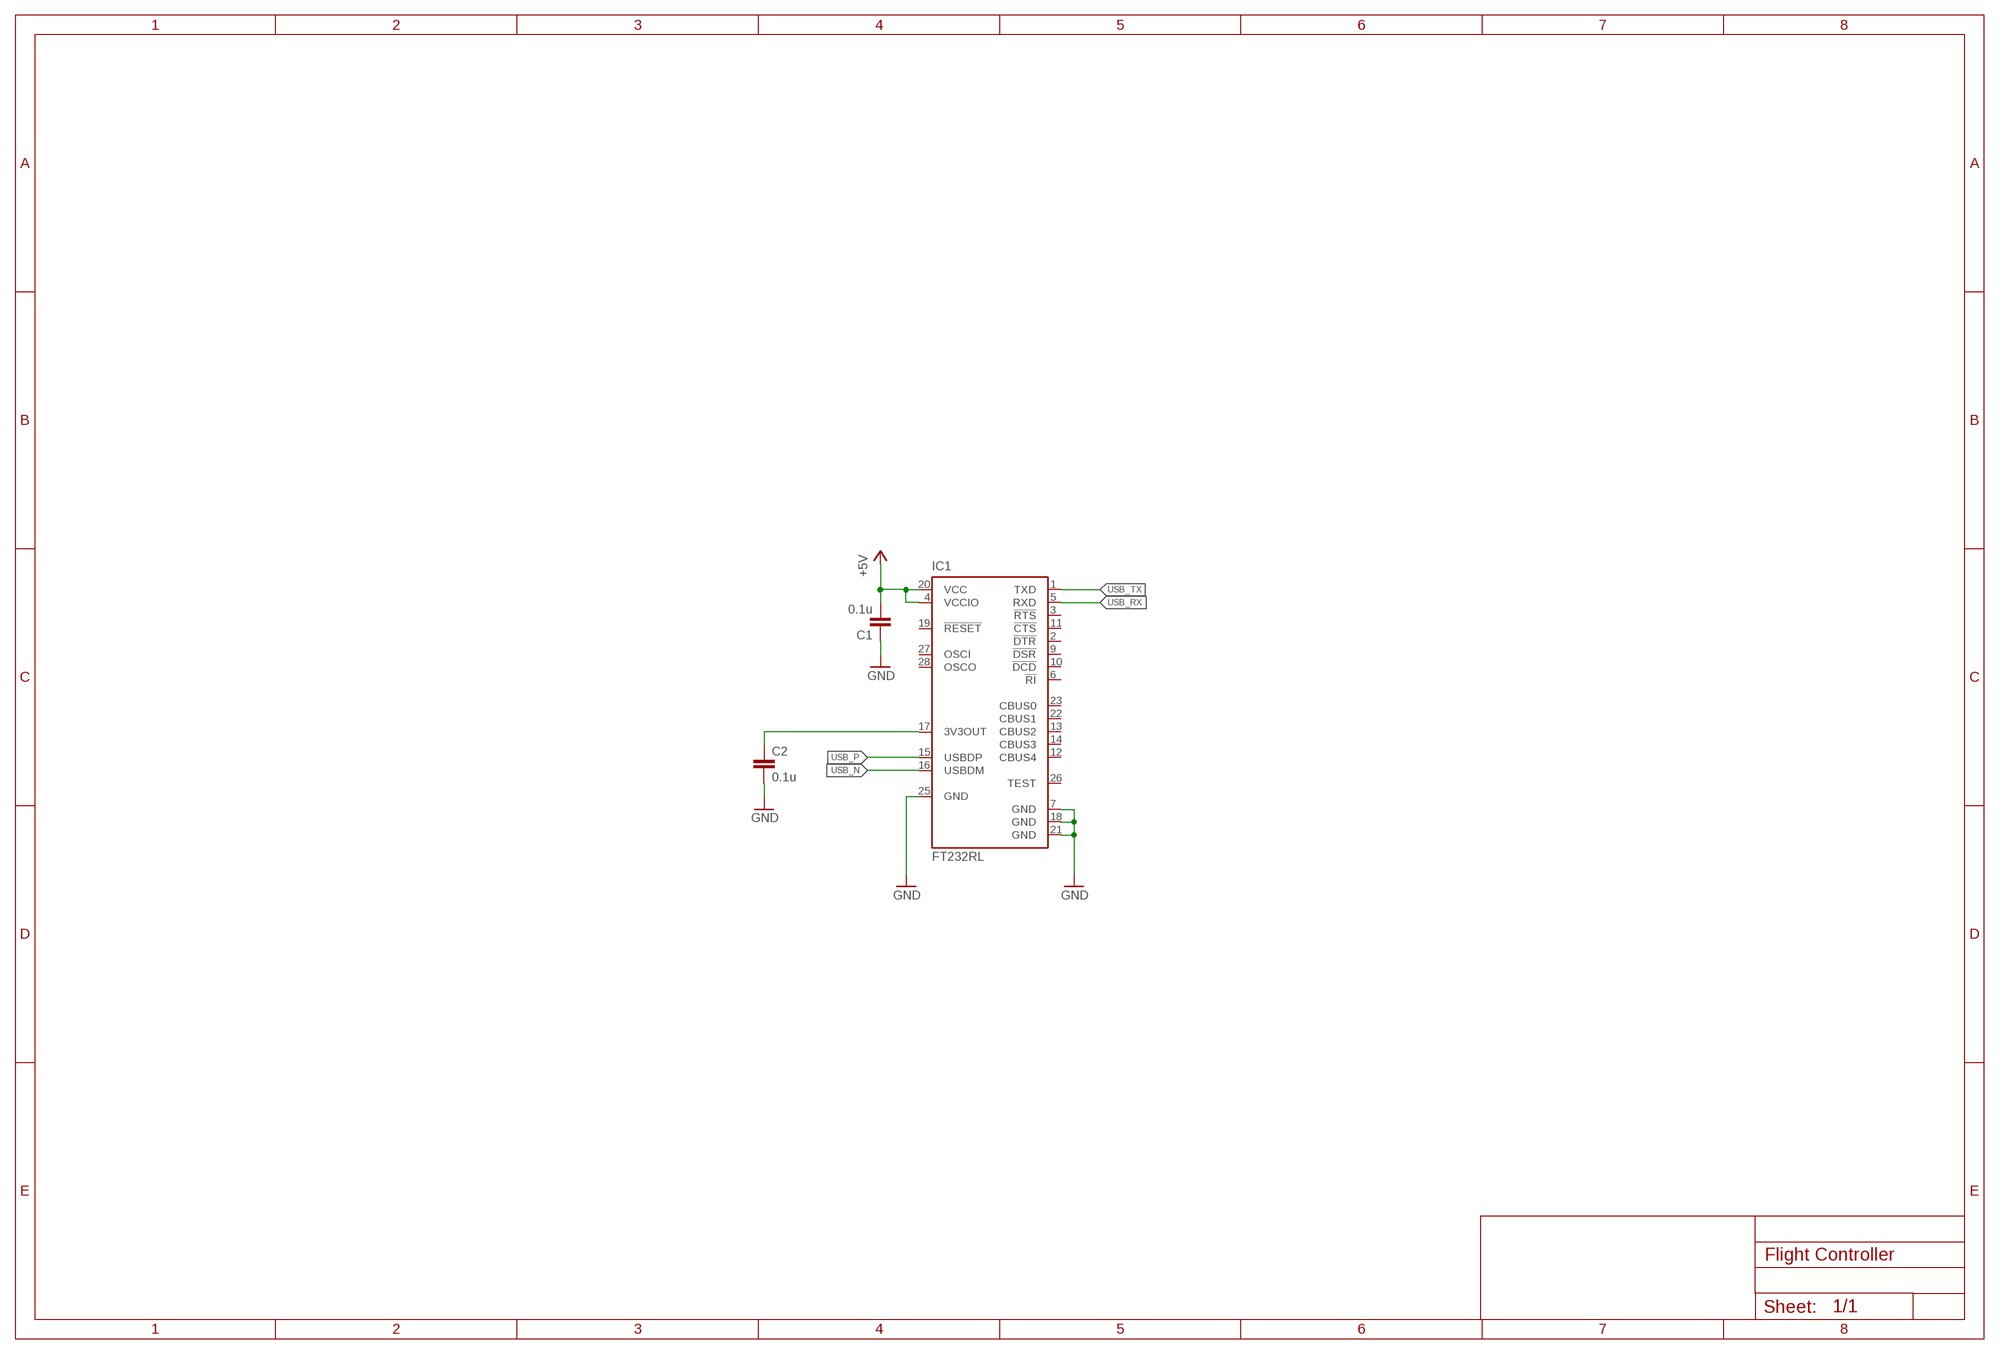
[diagram p13: schematic, module FTDI, sheet 1]

### Parts
C1  0.1u  C-EUC0603  [C0603]
C2  0.1u  C-EUC0603  [C0603]
IC1  FT232RL  [SSOP28]

### Nets
+5V: C1.2 IC1.4(VCCIO) IC1.20(VCC)
GND: C1.1 C2.2 IC1.7(GND) IC1.18(GND) IC1.21(GND) IC1.25(GND)
N$5: C2.1 IC1.17(3V3OUT)
USB_N: IC1.16(USBDM)
USB_P: IC1.15(USBDP)
USB_RX: IC1.5(RXD)
USB_TX: IC1.1(TXD)
Unconnected: IC1.2(!DTR) IC1.3(!RTS) IC1.6(!RI) IC1.9(!DSR) IC1.10(!DCD) IC1.11(!CTS) IC1.12(CBUS4) IC1.13(CBUS2) IC1.14(CBUS3) IC1.19(!RESET) IC1.22(CBUS1) IC1.23(CBUS0) IC1.26(TEST) IC1.27(OSCI) IC1.28(OSCO)

### Library data of the parts
C1 C2 = rcl:C-EU: CAPACITOR, European symbol
IC1 = ftdichip:FT232R: Source: http://www.ftdichip.com/Documents/DataSheets/DS_FT232R_v104.pdf; MPN: FT232RL; OC_FARNELL: 1146032; OC_NEWARK: 91K9918

## Module CONTINUTITY
Ports: +3V3(pwr) !CONT_EN(in) PWR/PYRO+(out)
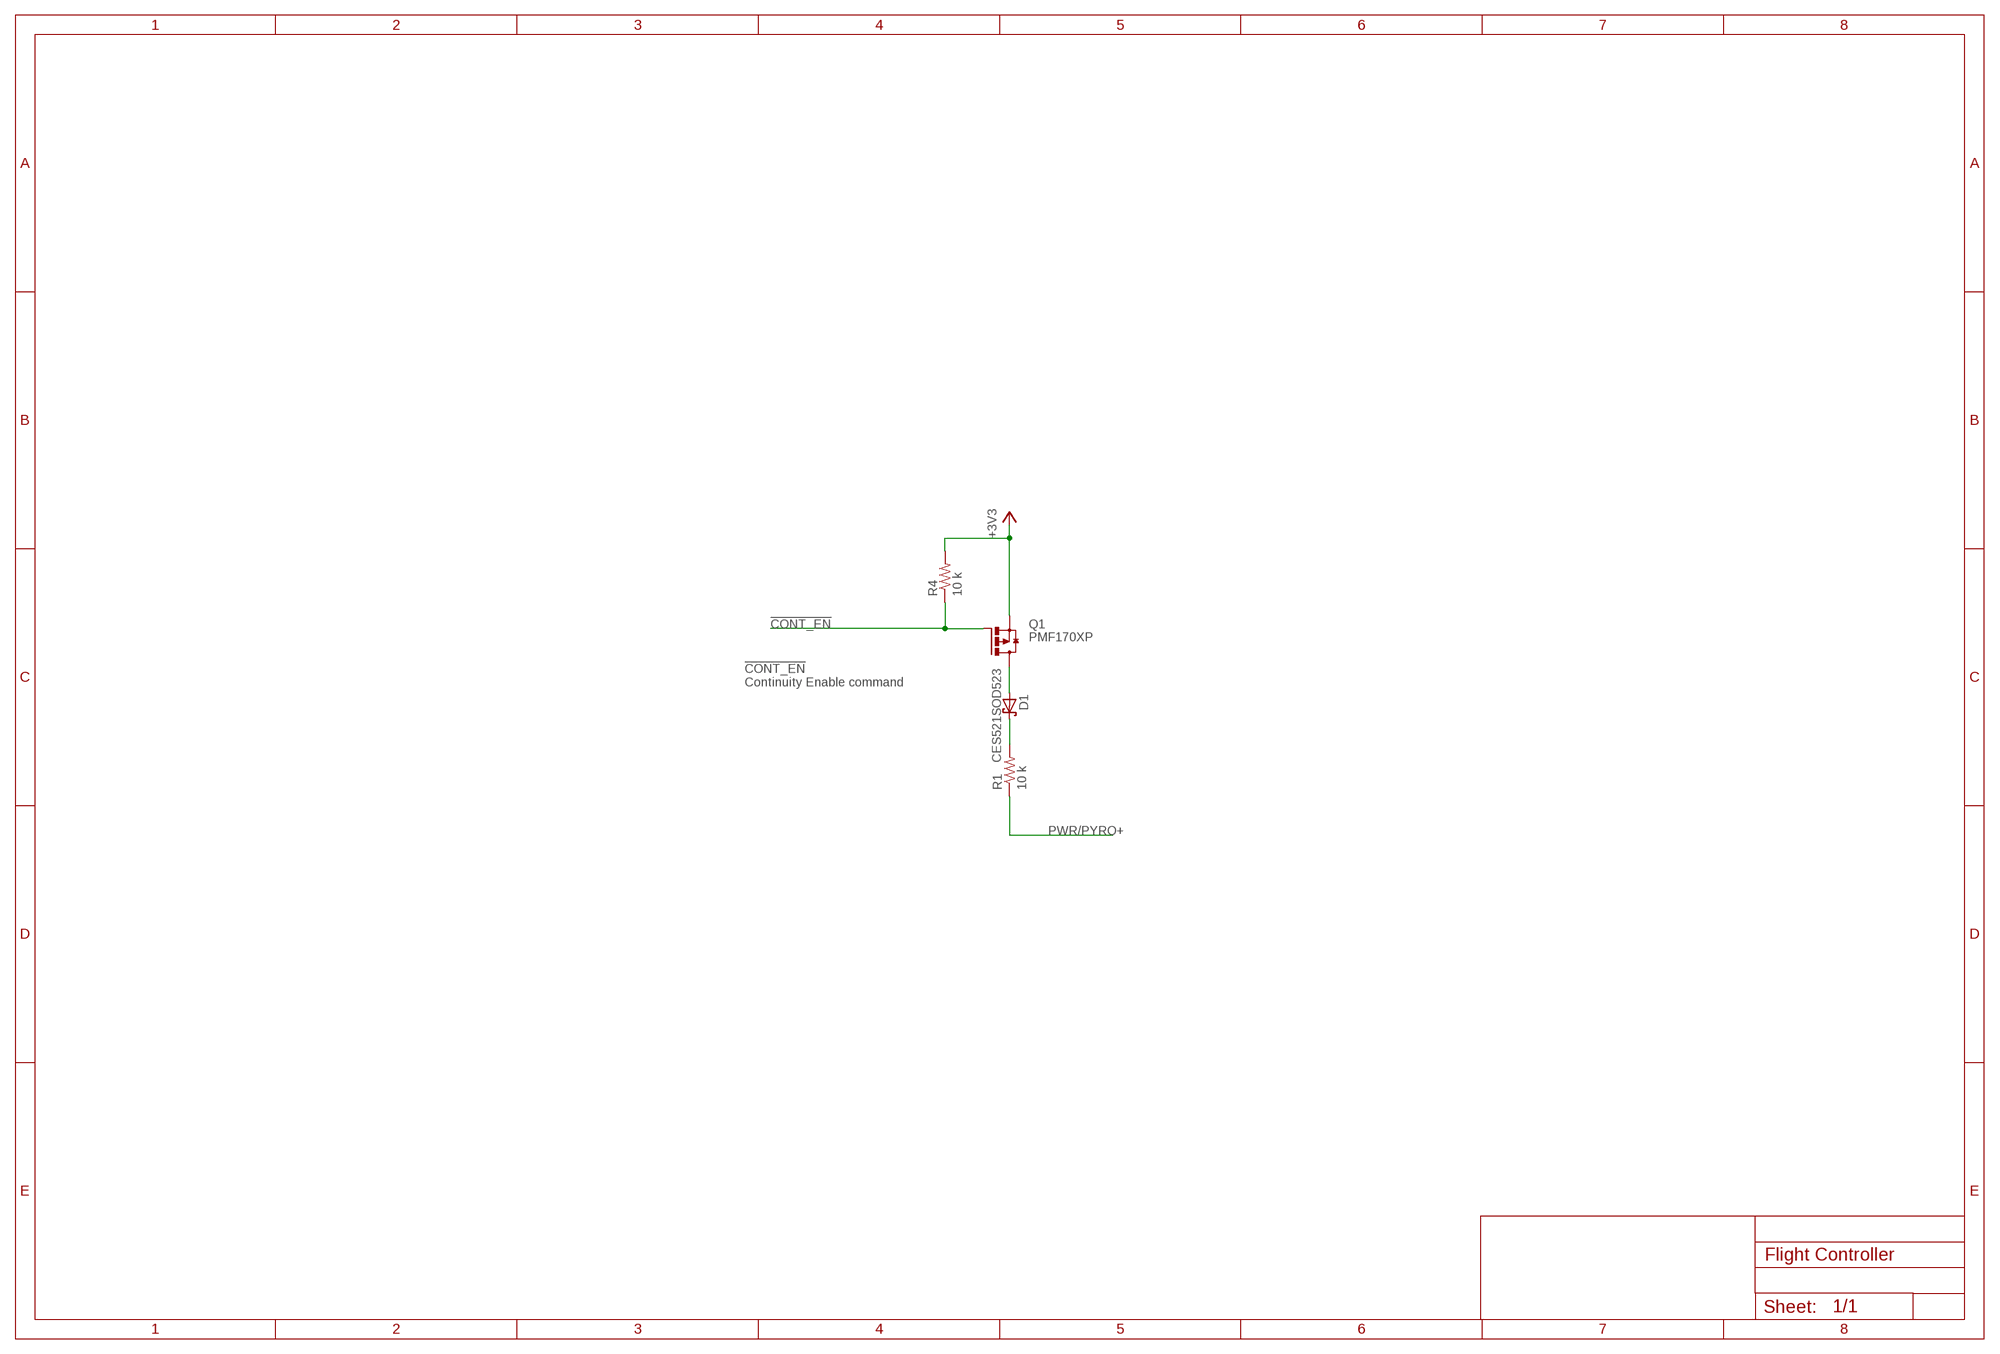
[diagram p14: schematic, module CONTINUTITY, sheet 1]

### Parts
D1  CES521SOD523  [SOD523]
Q1  PMF170XP  [SOT323]
R1  10 k  R-US_R0603  [R0603]
R4  10 k  R-US_R0603  [R0603]

### Nets
!CONT_EN: Q1.2(G) R4.1
+3V3: Q1.3(S) R4.2
N$2: D1.A Q1.1(D)
N$3: D1.C R1.2
PWR/PYRO+: R1.1

### Notes on the sheet
- !CONT_EN
  Continuity Enable command

### Library data of the parts
D1 = diode:CES521
Q1 = transistor-power:PMF170XP
R1 R4 = rcl:R-US_: RESISTOR, American symbol

## Net classes
0 default: clearance 0.205 mm
1 signals: width 0.13 mm, clearance 0.205 mm